# EAGLE design main (EAGLE 5.11)

## Sheet 1 of 7
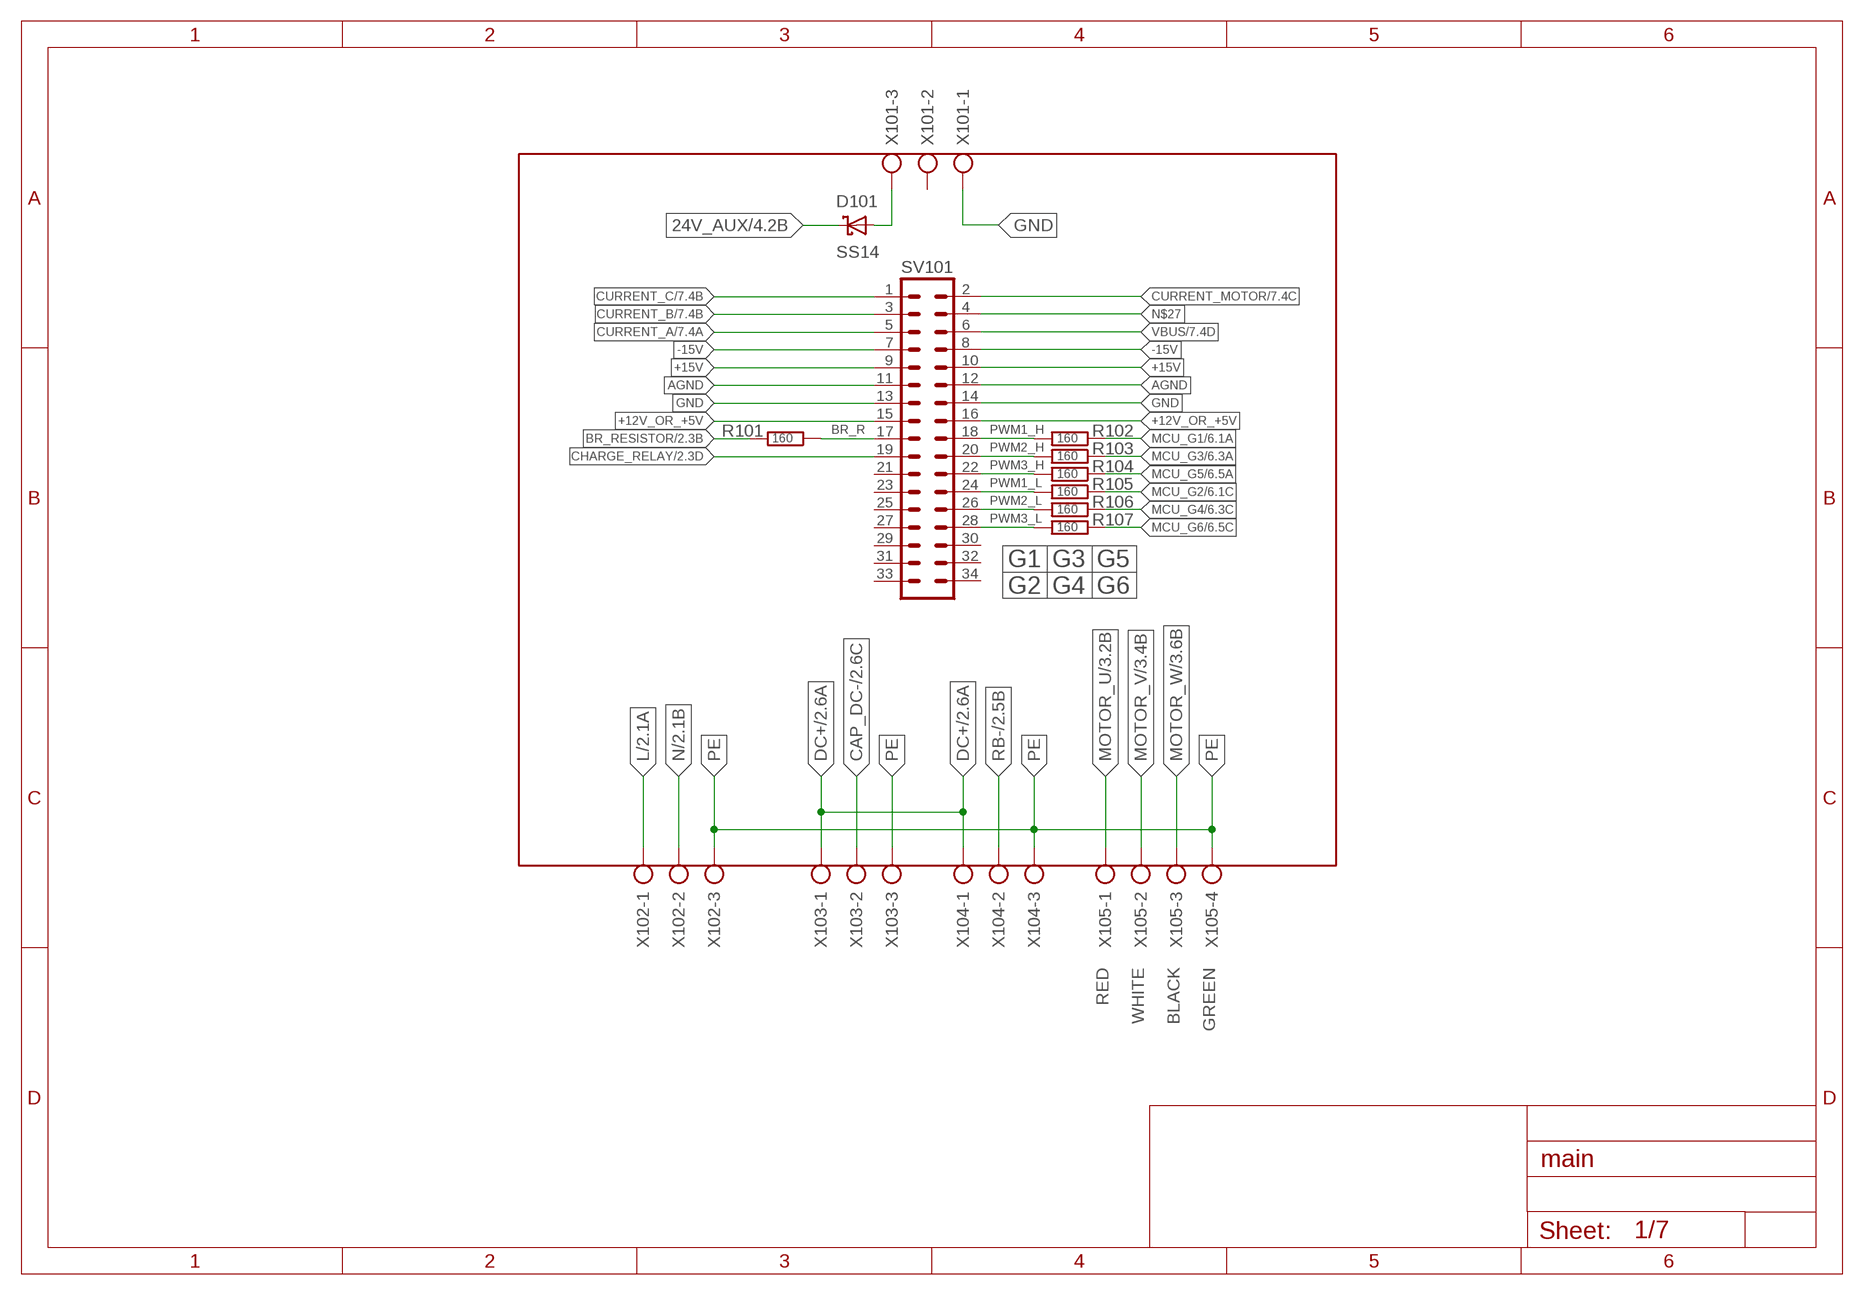
[diagram p0: schematic, sheet 1]

### Parts
D101  SS14  1N581SMD  [DO214AC]
R101  160  R-EU_R1206  [R1206]
R102  160  R-EU_R1206  [R1206]
R103  160  R-EU_R1206  [R1206]
R104  160  R-EU_R1206  [R1206]
R105  160  R-EU_R1206  [R1206]
R106  160  R-EU_R1206  [R1206]
R107  160  R-EU_R1206  [R1206]
SV101  ML34  [ML34]
X101  AK500/3-H  [AK500/3-H]
X102  AK500/3-H  [AK500/3-H]
X103  AK500/3-H  [AK500/3-H]
X104  AK500/3-H  [AK500/3-H]
X105  AK500/4-H  [AK500/4-H]

### Nets
24V_AUX: D101.C ; also sheet 4
+12V_OR_+5V: SV101.15 SV101.16 ; also sheet 2,4,5
+15V: SV101.9 SV101.10 ; also sheet 4,7
-15V: SV101.7 SV101.8 ; also sheet 4,7
AGND: SV101.11 SV101.12 ; also sheet 4,7
BR_R: R101.1 SV101.17
BR_RESISTOR: R101.2 ; also sheet 2
CAP_DC-: X103.2 ; also sheet 2,7
CHARGE_RELAY: SV101.19 ; also sheet 2
CURRENT_A: SV101.5 ; also sheet 7
CURRENT_B: SV101.3 ; also sheet 7
CURRENT_C: SV101.1 ; also sheet 7
CURRENT_MOTOR: SV101.2 ; also sheet 7
DC+: X103.1 X104.1 ; also sheet 2,3
GND: SV101.13 SV101.14 X101.1 ; also sheet 2,4,5,6
L: X102.1 ; also sheet 2
MCU_G1: R102.1 ; also sheet 6
MCU_G2: R105.1 ; also sheet 6
MCU_G3: R103.1 ; also sheet 6
MCU_G4: R106.1 ; also sheet 6
MCU_G5: R104.1 ; also sheet 6
MCU_G6: R107.1 ; also sheet 6
MOTOR_U: X105.1 ; also sheet 3,7
MOTOR_V: X105.2 ; also sheet 3,7
MOTOR_W: X105.3 ; also sheet 3,7
N: X102.2 ; also sheet 2
N$27: SV101.4
N$42: D101.A X101.3
PE: X102.3 X103.3 X104.3 X105.4
PWM1_H: R102.2 SV101.18
PWM1_L: R105.2 SV101.24
PWM2_H: R103.2 SV101.20
PWM2_L: R106.2 SV101.26
PWM3_H: R104.2 SV101.22
PWM3_L: R107.2 SV101.28
RB-: X104.2 ; also sheet 2
VBUS: SV101.6 ; also sheet 7
Unconnected: SV101.21 SV101.23 SV101.25 SV101.27 SV101.29 SV101.30 SV101.31 SV101.32 SV101.33 SV101.34 X101.2

### Notes on the sheet
- G1 | G3 | G5
- G2 | G4 | G6
- RED | WHITE | BLACK | GREEN

## Sheet 2 of 7
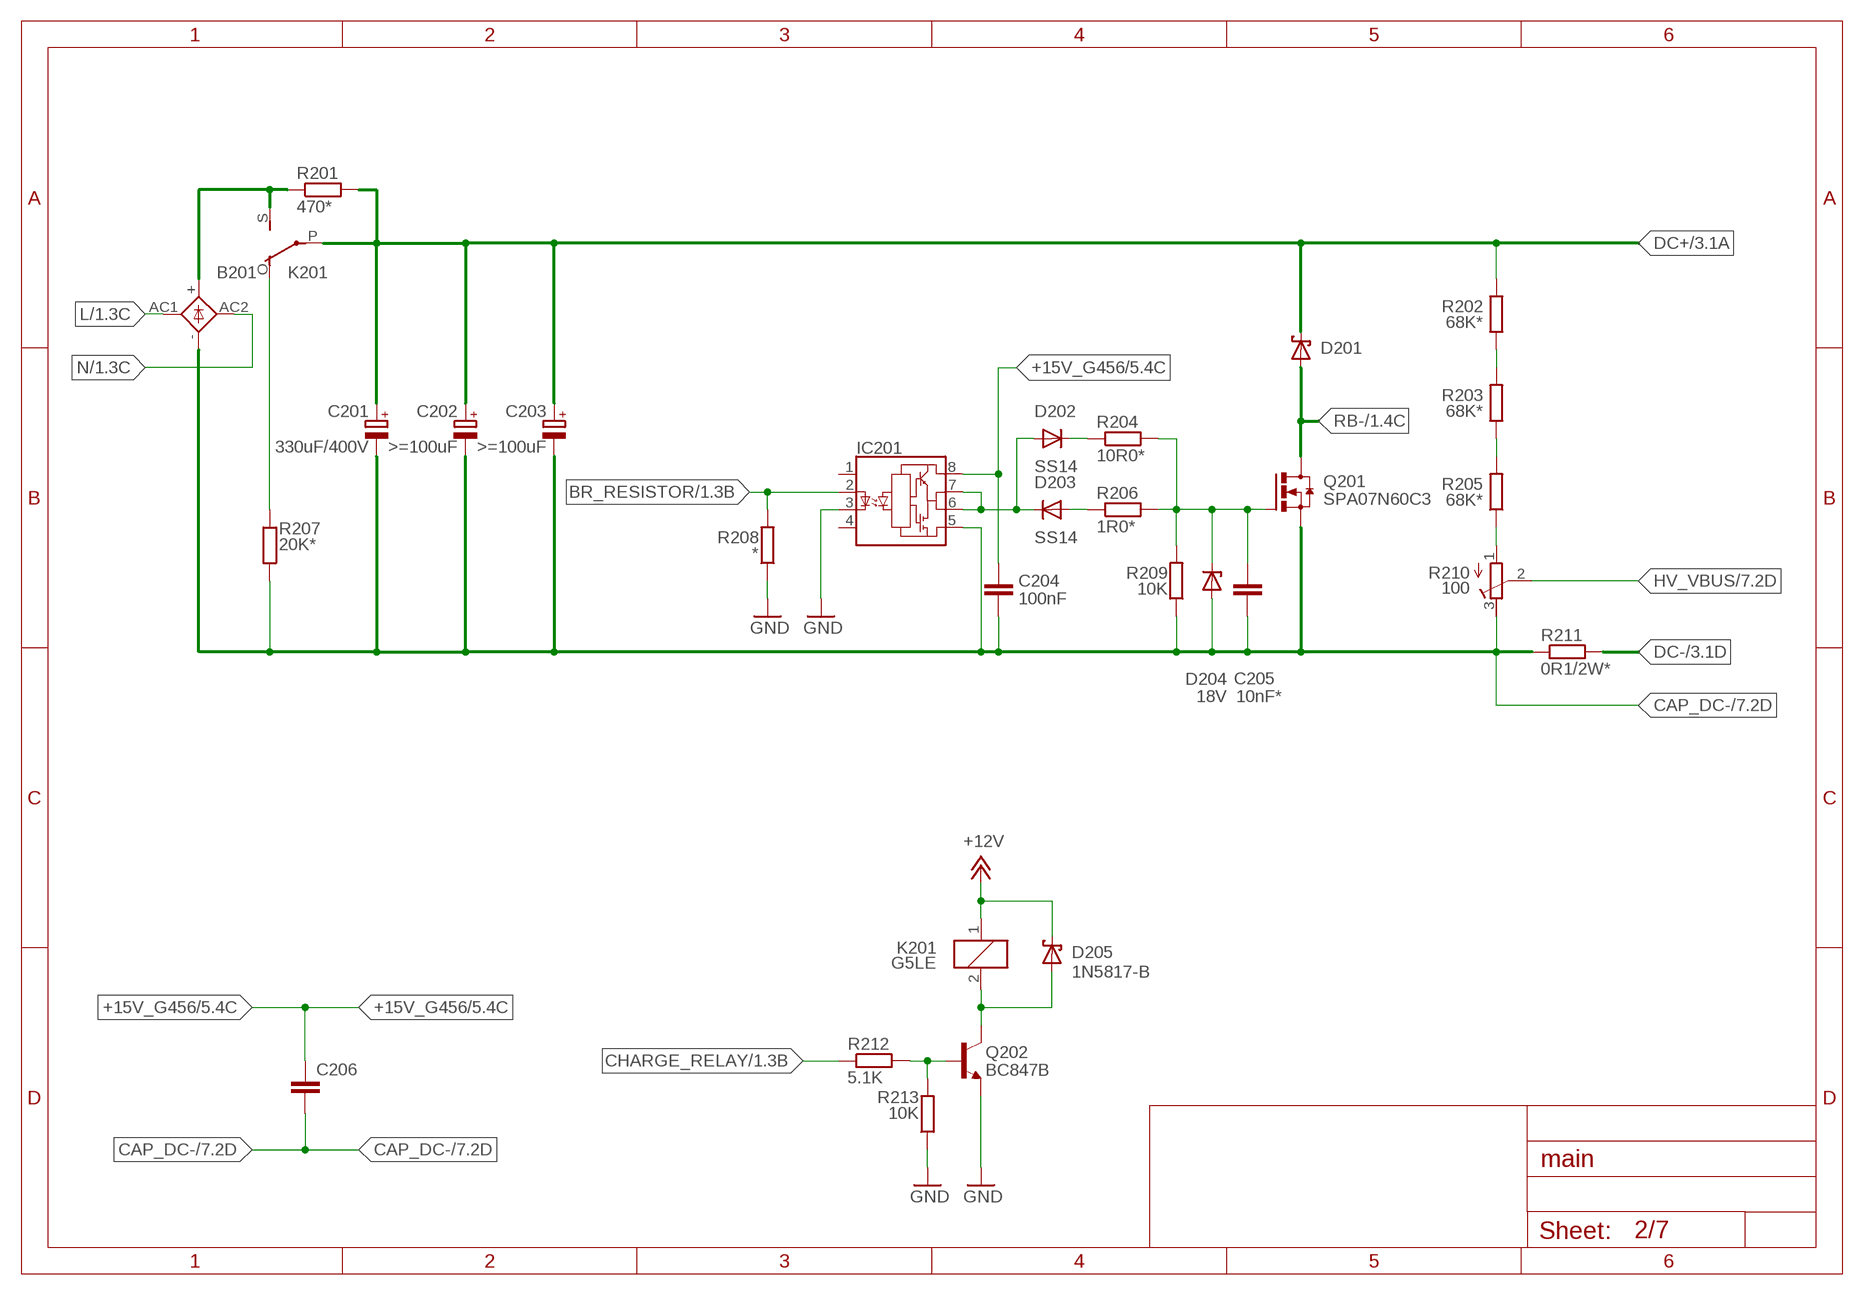
[diagram p1: schematic, sheet 2]

### Parts
B201  KBU  [KBU]
C201  330uF/400V  CPOL-EUE10-22.5  [EB22,5D]
C202  >=100uF  CPOL-EUE10-22.5  [EB22,5D]
C203  >=100uF  CPOL-EUE10-22.5  [EB22,5D]
C204  100nF  C-EUC0603  [C0603]
C205  10nF*  C-EUC0805  [C0805]
C206  C-EUC1206  [C1206]
D201  1N581SMD  [DO214AC]
D202  SS14  DIODE-DO214AA  [DO214AA]
D203  SS14  DIODE-DO214AA  [DO214AA]
D204  18V  ZENER-DIODESOD80C  [SOD80C]
D205  1N5817-B  1N581SMD  [DO214AC]
IC201  ELDI  [DIL8-SMD]
K201  G5LE  [G5LE]
Q201  SPA07N60C3  IRFZ48  [TO220BH-HV1]
Q202  BC847B  BC849SMD  [SOT23-BEC]
R201  470*  R-EU_VTA52  [VTA52]
R202  68K*  R-EU_0204/2V  [0204V]
R203  68K*  R-EU_0204/2V  [0204V]
R204  10R0*  R-EU_R0805  [R0805]
R205  68K*  R-EU_0204/2V  [0204V]
R206  1R0*  R-EU_R0805  [R0805]
R207  20K*  R-EU_RDH/15  [RDH/15]
R208  *  R-EU_R1206  [R1206]
R209  10K  R-EU_M0805  [M0805]
R210  100  R-TRIMM3296W  [RTRIM3296W]
R211  0R1/2W*  R-EU_R2512  [R2512]
R212  5.1K  R-EU_R0805  [R0805]
R213  10K  R-EU_R0805  [R0805]

### Nets
+12V_OR_+5V: D205.C K201.1 ; supply symbol labelled +12V ; also sheet 1,4,5
+15V_G456: C204.1 C206.1 IC201.8 ; also sheet 5,6,7
BR_RESISTOR: IC201.2 R208.2 ; also sheet 1
CAP_DC-: B201.- C201.- C202.- C203.- C204.2 C205.2 C206.2 D204.A IC201.5 Q201.S R207.1 R209.1 R210.3(A) R211.1 ; also sheet 1,7
CHARGE_RELAY: R212.1 ; also sheet 1
DC+: C201.+ C202.+ C203.+ D201.C K201.P(2:P) R201.2 R202.2 ; also sheet 1,3
DC-: R211.2 ; also sheet 3,5,6,7
GND: IC201.3 Q202.E R208.1 R213.1 ; also sheet 1,4,5,6
HV_VBUS: R210.2(S) ; also sheet 7
L: B201.AC1 ; also sheet 1
N: B201.AC2 ; also sheet 1
N$5: D202.A D203.C IC201.6 IC201.7
N$9: K201.O(2:O) R207.2
N$10: R203.1 R205.2
N$11: D202.C R204.1
N$12: D203.A R206.1
N$13: C205.1 D204.C Q201.G R204.2 R206.2 R209.2
N$14: B201.+ K201.S(2:S) R201.1
N$16: R202.1 R203.2
N$24: R205.1 R210.1(E)
N$31: D205.A K201.2 Q202.C
N$32: Q202.B R212.2 R213.2
RB-: D201.A Q201.D ; also sheet 1
Unconnected: IC201.1 IC201.4

## Sheet 3 of 7
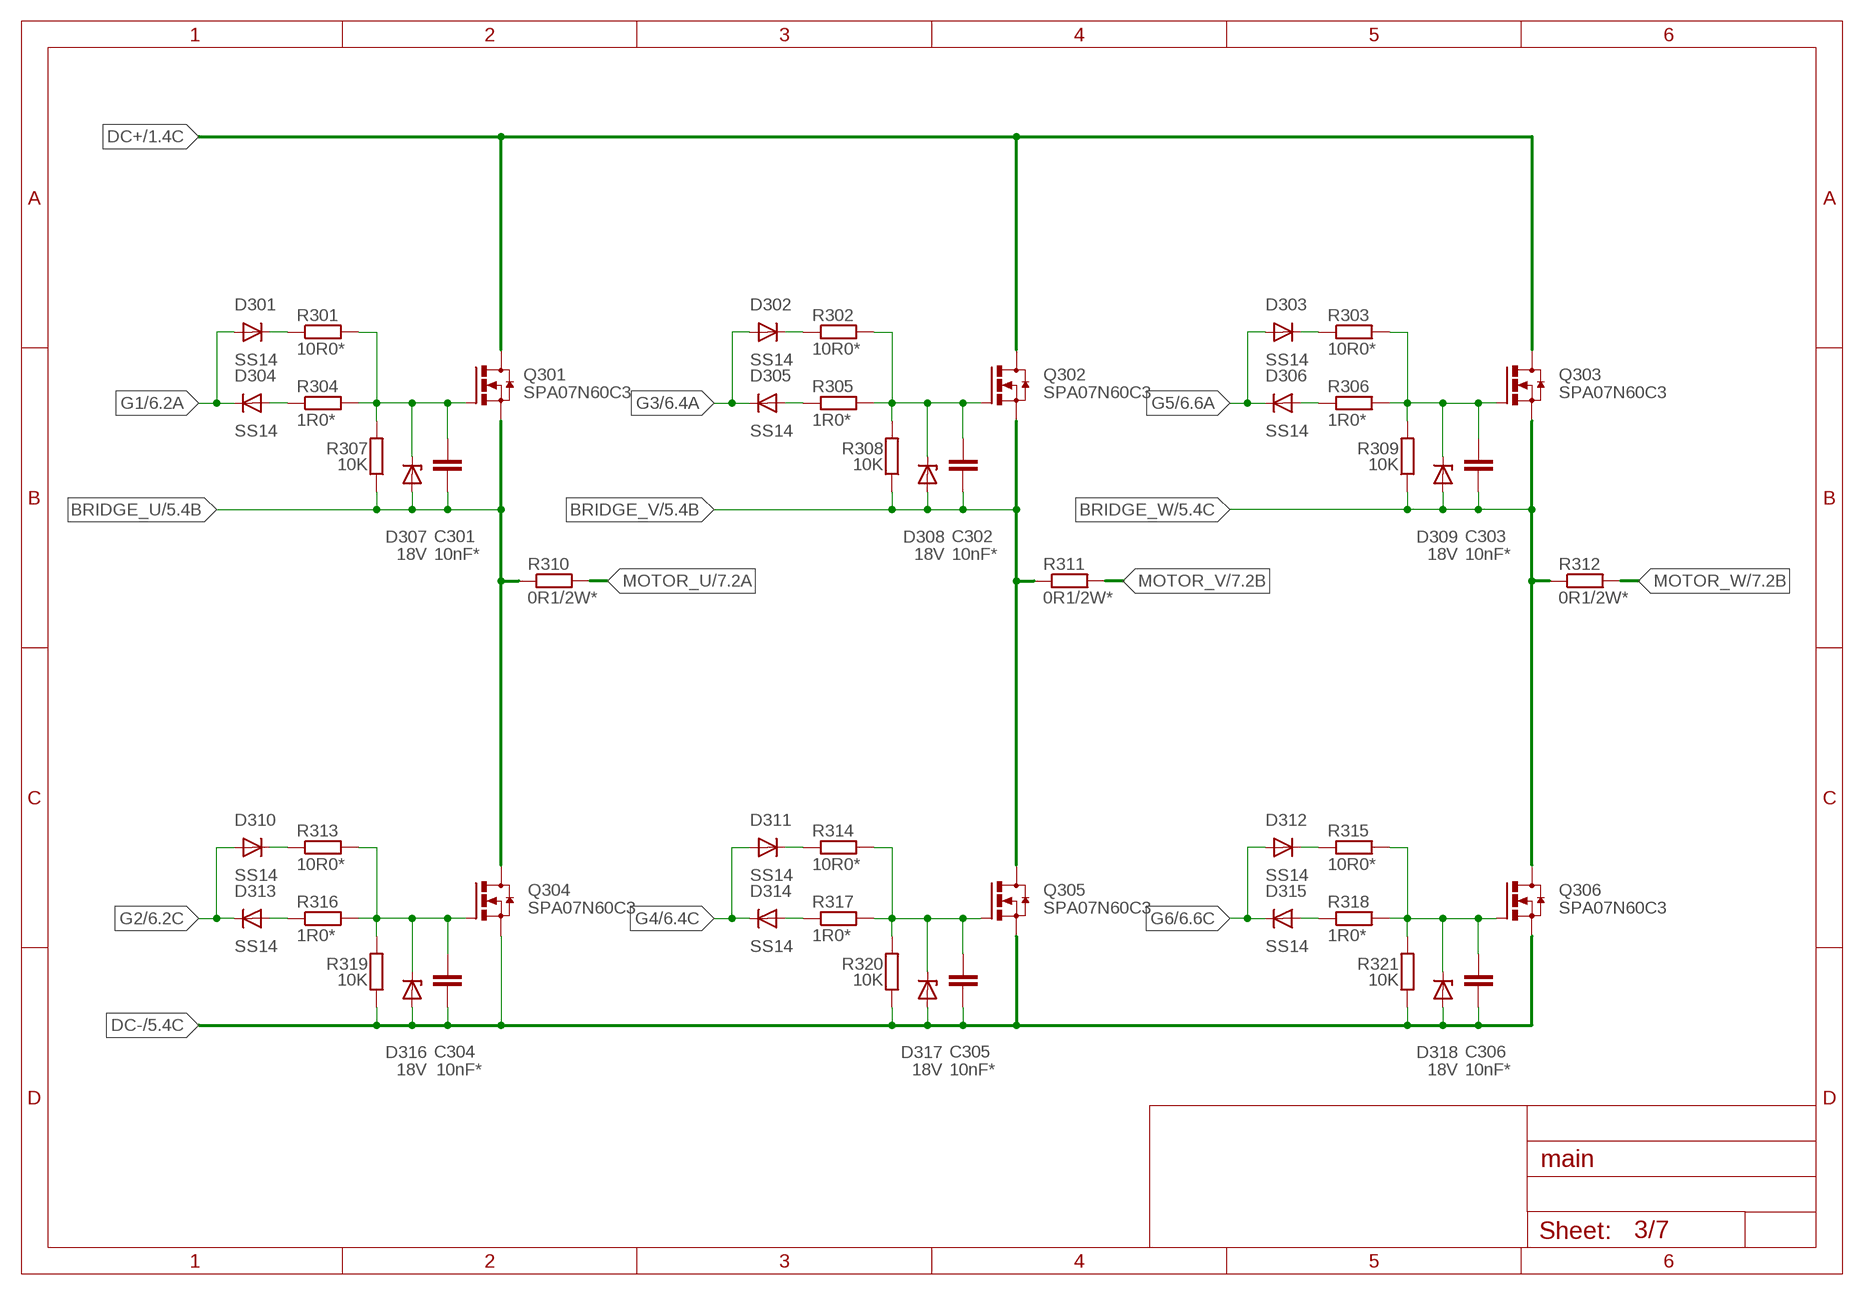
[diagram p2: schematic, sheet 3]

### Parts
C301  10nF*  C-EUC0805  [C0805]
C302  10nF*  C-EUC0805  [C0805]
C303  10nF*  C-EUC0805  [C0805]
C304  10nF*  C-EUC0805  [C0805]
C305  10nF*  C-EUC0805  [C0805]
C306  10nF*  C-EUC0805  [C0805]
D301  SS14  DIODE-DO214AA  [DO214AA]
D302  SS14  DIODE-DO214AA  [DO214AA]
D303  SS14  DIODE-DO214AA  [DO214AA]
D304  SS14  DIODE-DO214AA  [DO214AA]
D305  SS14  DIODE-DO214AA  [DO214AA]
D306  SS14  DIODE-DO214AA  [DO214AA]
D307  18V  ZENER-DIODESOD80C  [SOD80C]
D308  18V  ZENER-DIODESOD80C  [SOD80C]
D309  18V  ZENER-DIODESOD80C  [SOD80C]
D310  SS14  DIODE-DO214AA  [DO214AA]
D311  SS14  DIODE-DO214AA  [DO214AA]
D312  SS14  DIODE-DO214AA  [DO214AA]
D313  SS14  DIODE-DO214AA  [DO214AA]
D314  SS14  DIODE-DO214AA  [DO214AA]
D315  SS14  DIODE-DO214AA  [DO214AA]
D316  18V  ZENER-DIODESOD80C  [SOD80C]
D317  18V  ZENER-DIODESOD80C  [SOD80C]
D318  18V  ZENER-DIODESOD80C  [SOD80C]
Q301  SPA07N60C3  IRFZ48  [TO220BH-HV1]
Q302  SPA07N60C3  IRFZ48  [TO220BH-HV1]
Q303  SPA07N60C3  IRFZ48  [TO220BH-HV1]
Q304  SPA07N60C3  IRFZ48  [TO220BH-HV1]
Q305  SPA07N60C3  IRFZ48  [TO220BH-HV1]
Q306  SPA07N60C3  IRFZ48  [TO220BH-HV1]
R301  10R0*  R-EU_R0805  [R0805]
R302  10R0*  R-EU_R0805  [R0805]
R303  10R0*  R-EU_R0805  [R0805]
R304  1R0*  R-EU_R0805  [R0805]
R305  1R0*  R-EU_R0805  [R0805]
R306  1R0*  R-EU_R0805  [R0805]
R307  10K  R-EU_M0805  [M0805]
R308  10K  R-EU_M0805  [M0805]
R309  10K  R-EU_M0805  [M0805]
R310  0R1/2W*  R-EU_R2512  [R2512]
R311  0R1/2W*  R-EU_R2512  [R2512]
R312  0R1/2W*  R-EU_R2512  [R2512]
R313  10R0*  R-EU_R0805  [R0805]
R314  10R0*  R-EU_R0805  [R0805]
R315  10R0*  R-EU_R0805  [R0805]
R316  1R0*  R-EU_R0805  [R0805]
R317  1R0*  R-EU_R0805  [R0805]
R318  1R0*  R-EU_R0805  [R0805]
R319  10K  R-EU_M0805  [M0805]
R320  10K  R-EU_M0805  [M0805]
R321  10K  R-EU_M0805  [M0805]

### Nets
BRIDGE_U: C301.2 D307.A Q301.S Q304.D R307.1 R310.1 ; also sheet 5,6,7
BRIDGE_V: C302.2 D308.A Q302.S Q305.D R308.1 R311.1 ; also sheet 5,6,7
BRIDGE_W: C303.2 D309.A Q303.S Q306.D R309.1 R312.1 ; also sheet 5,6,7
DC+: Q301.D Q302.D Q303.D ; also sheet 1,2
DC-: C304.2 C305.2 C306.2 D316.A D317.A D318.A Q304.S Q305.S Q306.S R319.1 R320.1 R321.1 ; also sheet 2,5,6,7
G1: D301.A D304.C ; also sheet 6
G2: D310.A D313.C ; also sheet 6
G3: D302.A D305.C ; also sheet 6
G4: D311.A D314.C ; also sheet 6
G5: D303.A D306.C ; also sheet 6
G6: D312.A D315.C ; also sheet 6
MOTOR_U: R310.2 ; also sheet 1,7
MOTOR_V: R311.2 ; also sheet 1,7
MOTOR_W: R312.2 ; also sheet 1,7
N$6: D311.C R314.1
N$7: C303.1 D309.C Q303.G R303.2 R306.2 R309.2
N$8: D310.C R313.1
N$26: D314.A R317.1
N$30: D313.A R316.1
N$35: C305.1 D317.C Q305.G R314.2 R317.2 R320.2
N$36: C304.1 D316.C Q304.G R313.2 R316.2 R319.2
N$37: D302.C R302.1
N$38: D305.A R305.1
N$39: D301.C R301.1
N$40: C302.1 D308.C Q302.G R302.2 R305.2 R308.2
N$41: D304.A R304.1
N$43: C301.1 D307.C Q301.G R301.2 R304.2 R307.2
N$44: D303.C R303.1
N$45: D306.A R306.1
N$47: D312.C R315.1
N$48: D315.A R318.1
N$49: C306.1 D318.C Q306.G R315.2 R318.2 R321.2

## Sheet 4 of 7
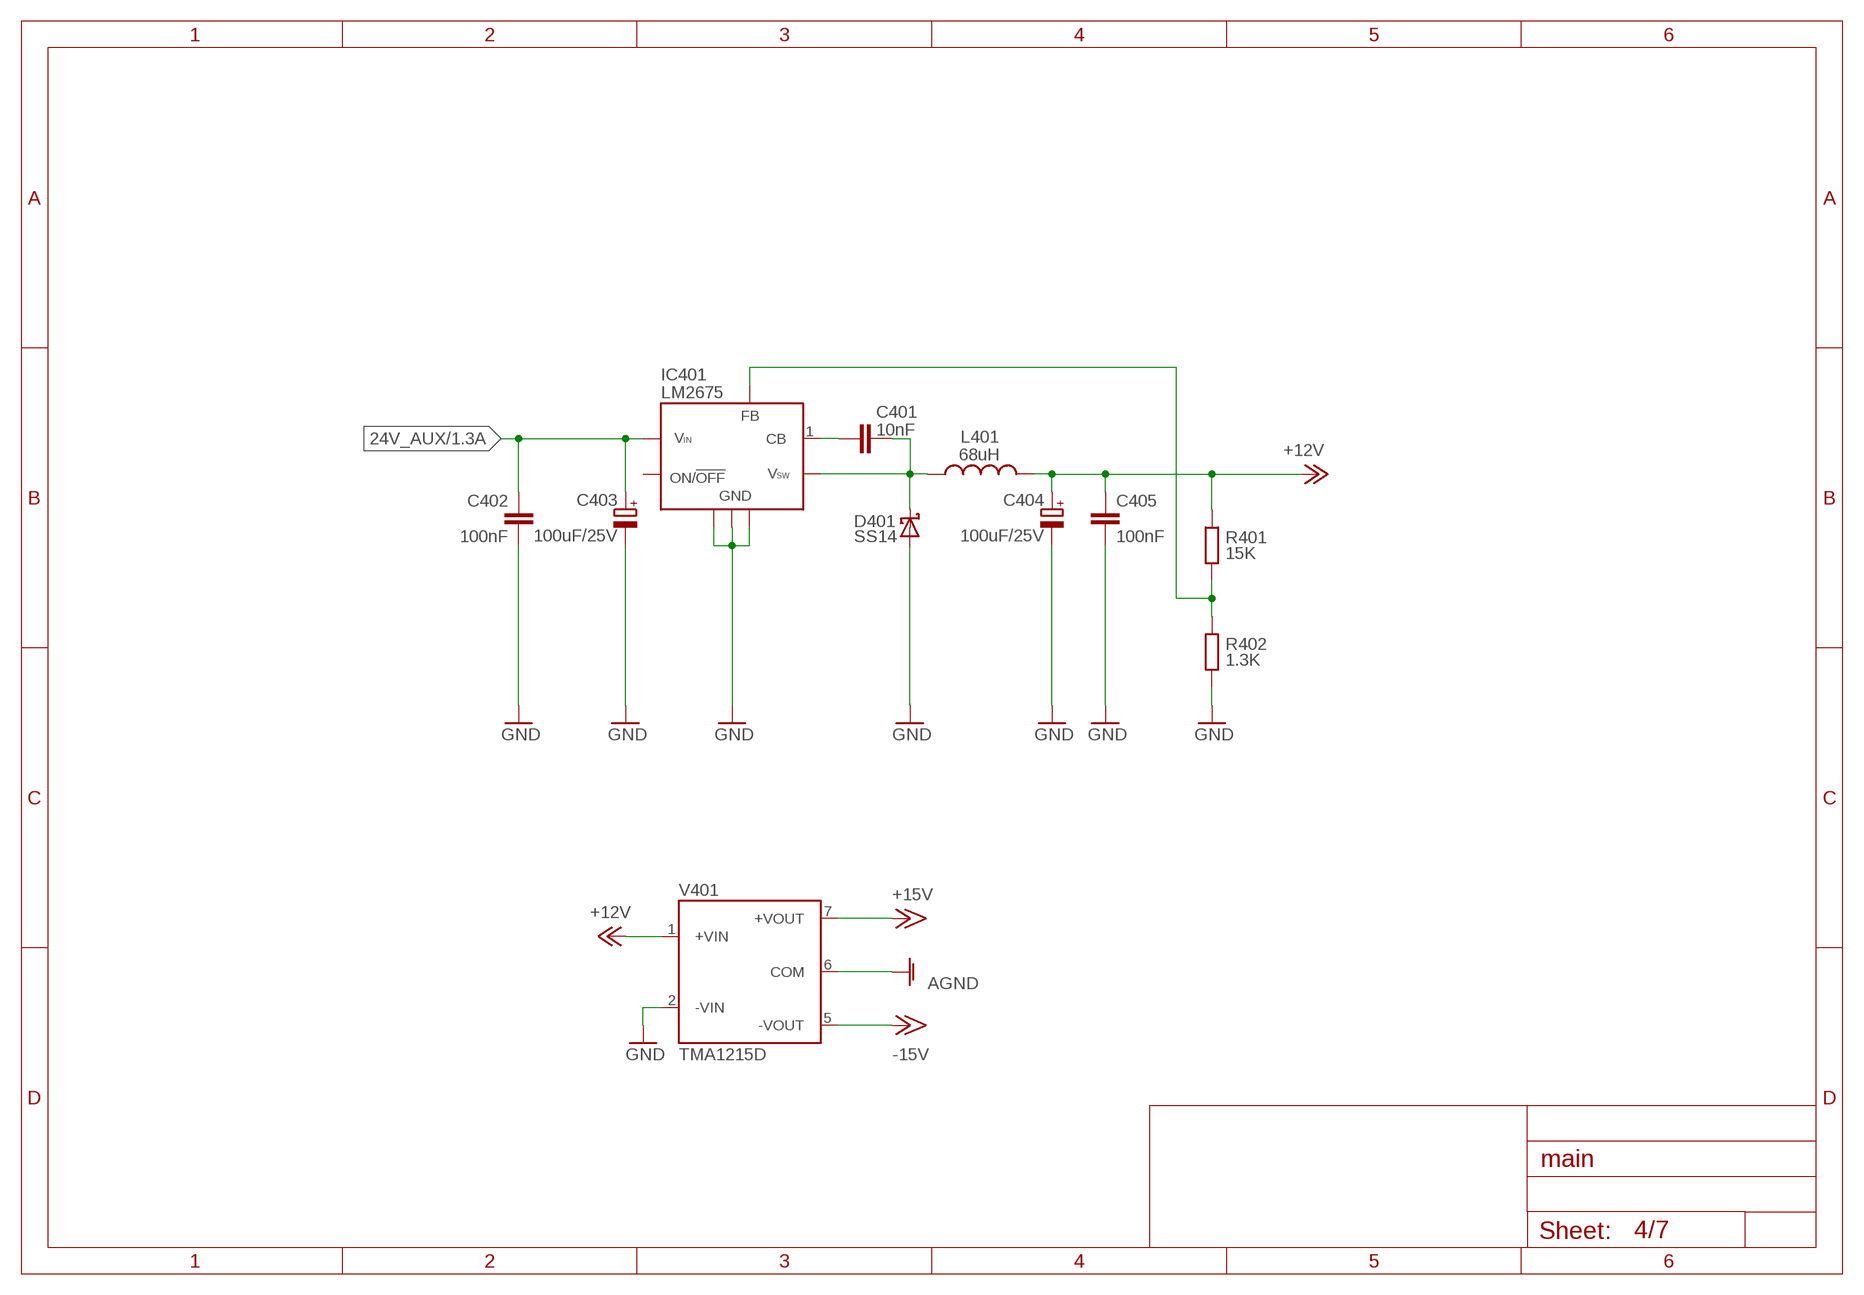
[diagram p3: schematic, sheet 4]

### Parts
C401  10nF  C-EUC0603  [C0603]
C402  100nF  C-EUC0603  [C0603]
C403  100uF/25V  CPOL-EUE2.5-5  [E2,5-5]
C404  100uF/25V  CPOL-EUE2,5-6E  [E2,5-6E]
C405  100nF  C-EUC0603  [C0603]
D401  SS14  1N581SMD  [DO214AC]
IC401  LM2675  [SO08]
L401  68uH  L-USSW45-V  [CW45-V]
R401  15K  R-EU_0204/2V  [0204V]
R402  1.3K  R-EU_R0603  [R0603]
V401  TMA1215D  TMA0515D  [TMA_DUAL]

### Nets
24V_AUX: C402.1 C403.+ IC401.7(VIN) ; also sheet 1
+12V_OR_+5V: C404.+ C405.1 L401.P$2 R401.2 V401.1(+VIN) ; supply symbol labelled +12V ; also sheet 1,2,5
+15V: V401.7(+VOUT) ; also sheet 1,7
-15V: V401.5(-VOUT) ; also sheet 1,7
AGND: V401.6(COM) ; also sheet 1,7
GND: C402.2 C403.- C404.- C405.2 D401.A IC401.2 IC401.3 IC401.6(GND) R402.1 V401.2(-VIN) ; also sheet 1,2,5,6
N$28: IC401.4(FB) R401.1 R402.2
N$72: C401.2 D401.C IC401.8(VSW) L401.P$1
N$80: C401.1 IC401.1(CB)
Unconnected: IC401.5(ON/!OFF)

## Sheet 5 of 7
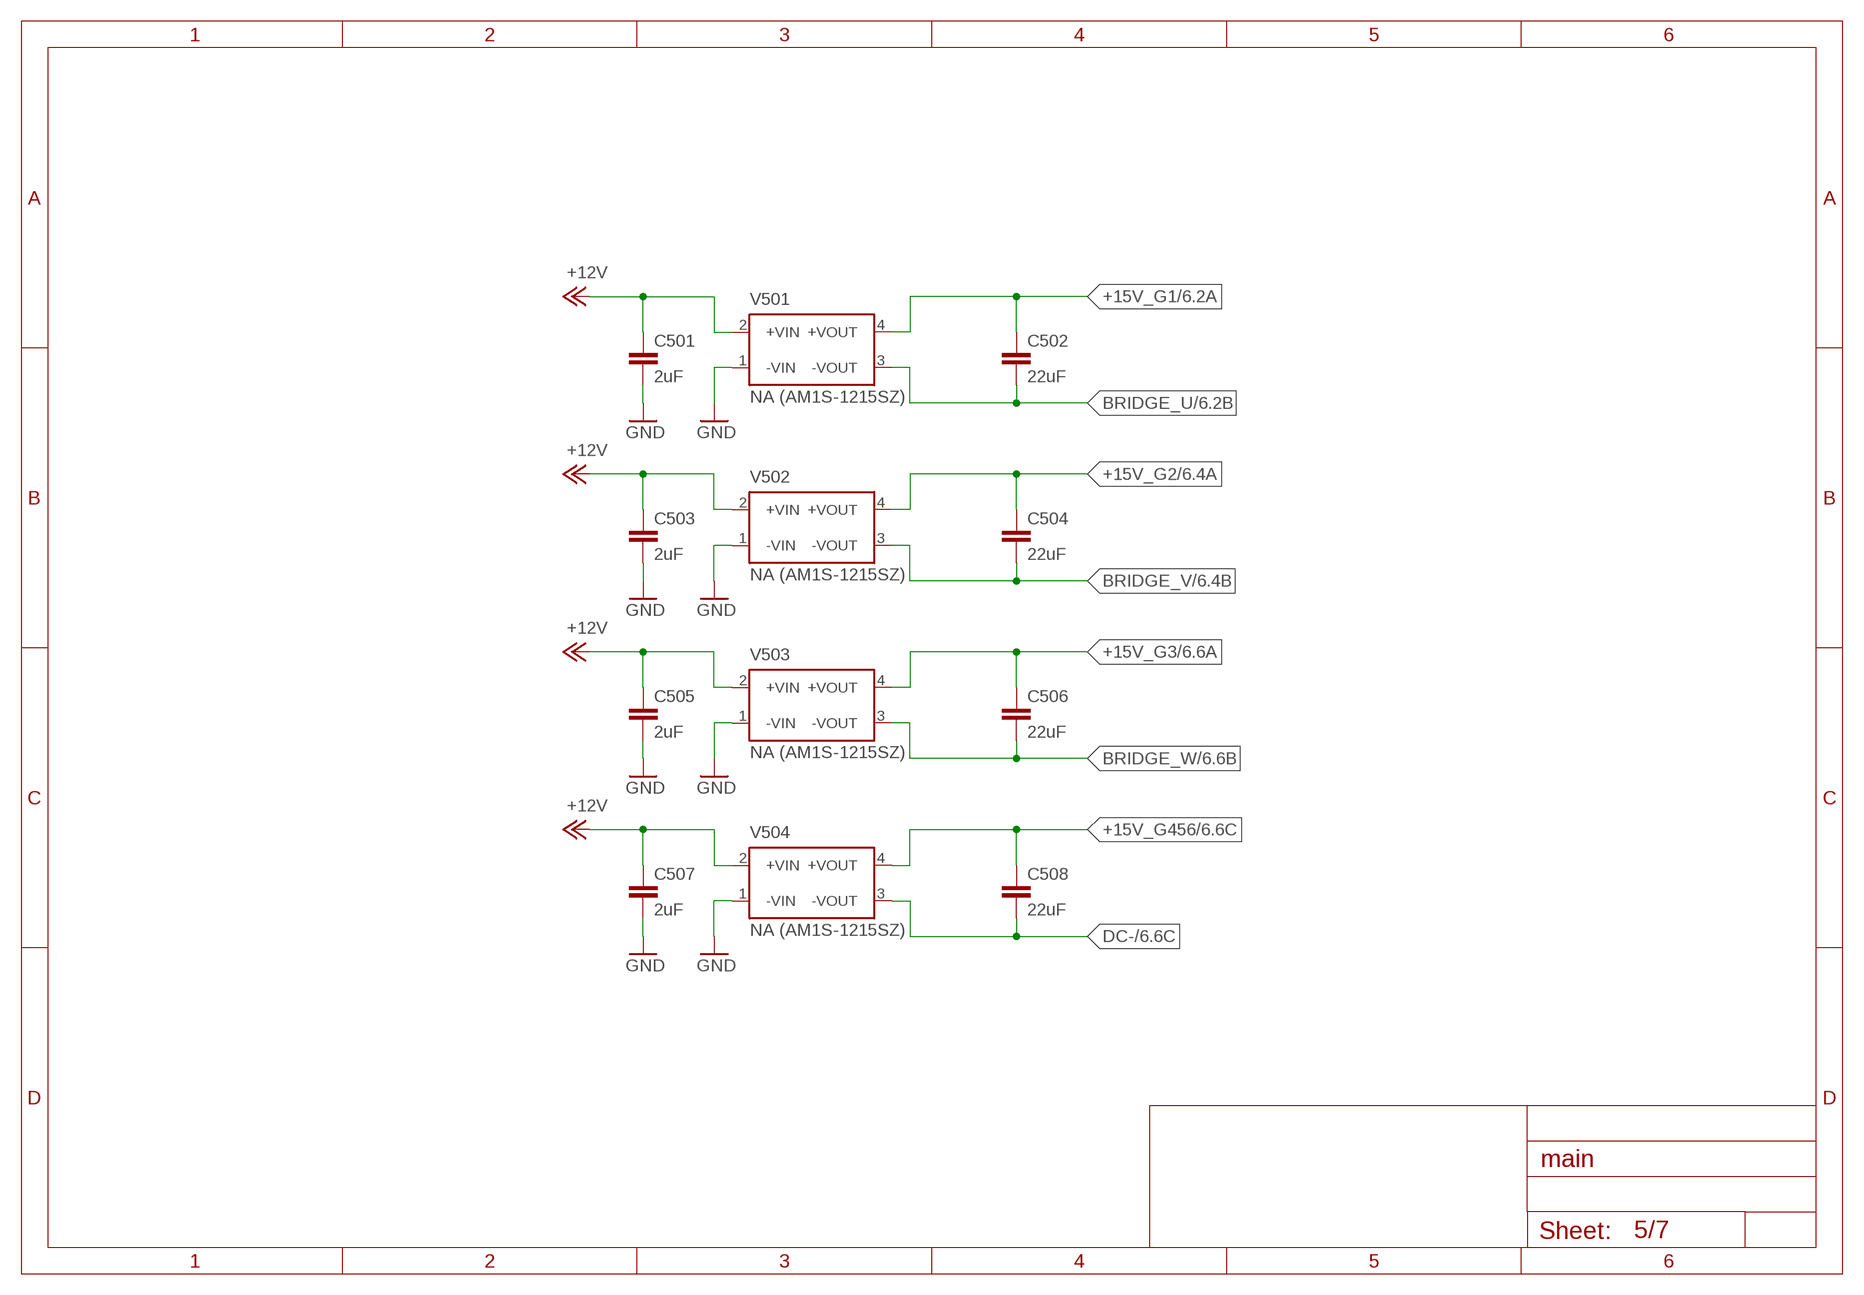
[diagram p4: schematic, sheet 5]

### Parts
C501  2uF  C-EUC1206  [C1206]
C502  22uF  C-EUC1206  [C1206]
C503  2uF  C-EUC1206  [C1206]
C504  22uF  C-EUC1206  [C1206]
C505  2uF  C-EUC1206  [C1206]
C506  22uF  C-EUC1206  [C1206]
C507  2uF  C-EUC1206  [C1206]
C508  22uF  C-EUC1206  [C1206]
V501  NA (AM1S-1215SZ)  TME0505S  [TME]
V502  NA (AM1S-1215SZ)  TME0505S  [TME]
V503  NA (AM1S-1215SZ)  TME0505S  [TME]
V504  NA (AM1S-1215SZ)  TME0505S  [TME]

### Nets
+12V_OR_+5V: C501.1 C503.1 C505.1 C507.1 V501.2(+VIN) V502.2(+VIN) V503.2(+VIN) V504.2(+VIN) ; supply symbol labelled +12V ; also sheet 1,2,4
+15V_G1: C502.1 V501.4(+VOUT) ; also sheet 6,7
+15V_G2: C504.1 V502.4(+VOUT) ; also sheet 6,7
+15V_G3: C506.1 V503.4(+VOUT) ; also sheet 6,7
+15V_G456: C508.1 V504.4(+VOUT) ; also sheet 2,6,7
BRIDGE_U: C502.2 V501.3(-VOUT) ; also sheet 3,6,7
BRIDGE_V: C504.2 V502.3(-VOUT) ; also sheet 3,6,7
BRIDGE_W: C506.2 V503.3(-VOUT) ; also sheet 3,6,7
DC-: C508.2 V504.3(-VOUT) ; also sheet 2,3,6,7
GND: C501.2 C503.2 C505.2 C507.2 V501.1(-VIN) V502.1(-VIN) V503.1(-VIN) V504.1(-VIN) ; also sheet 1,2,4,6

## Sheet 6 of 7
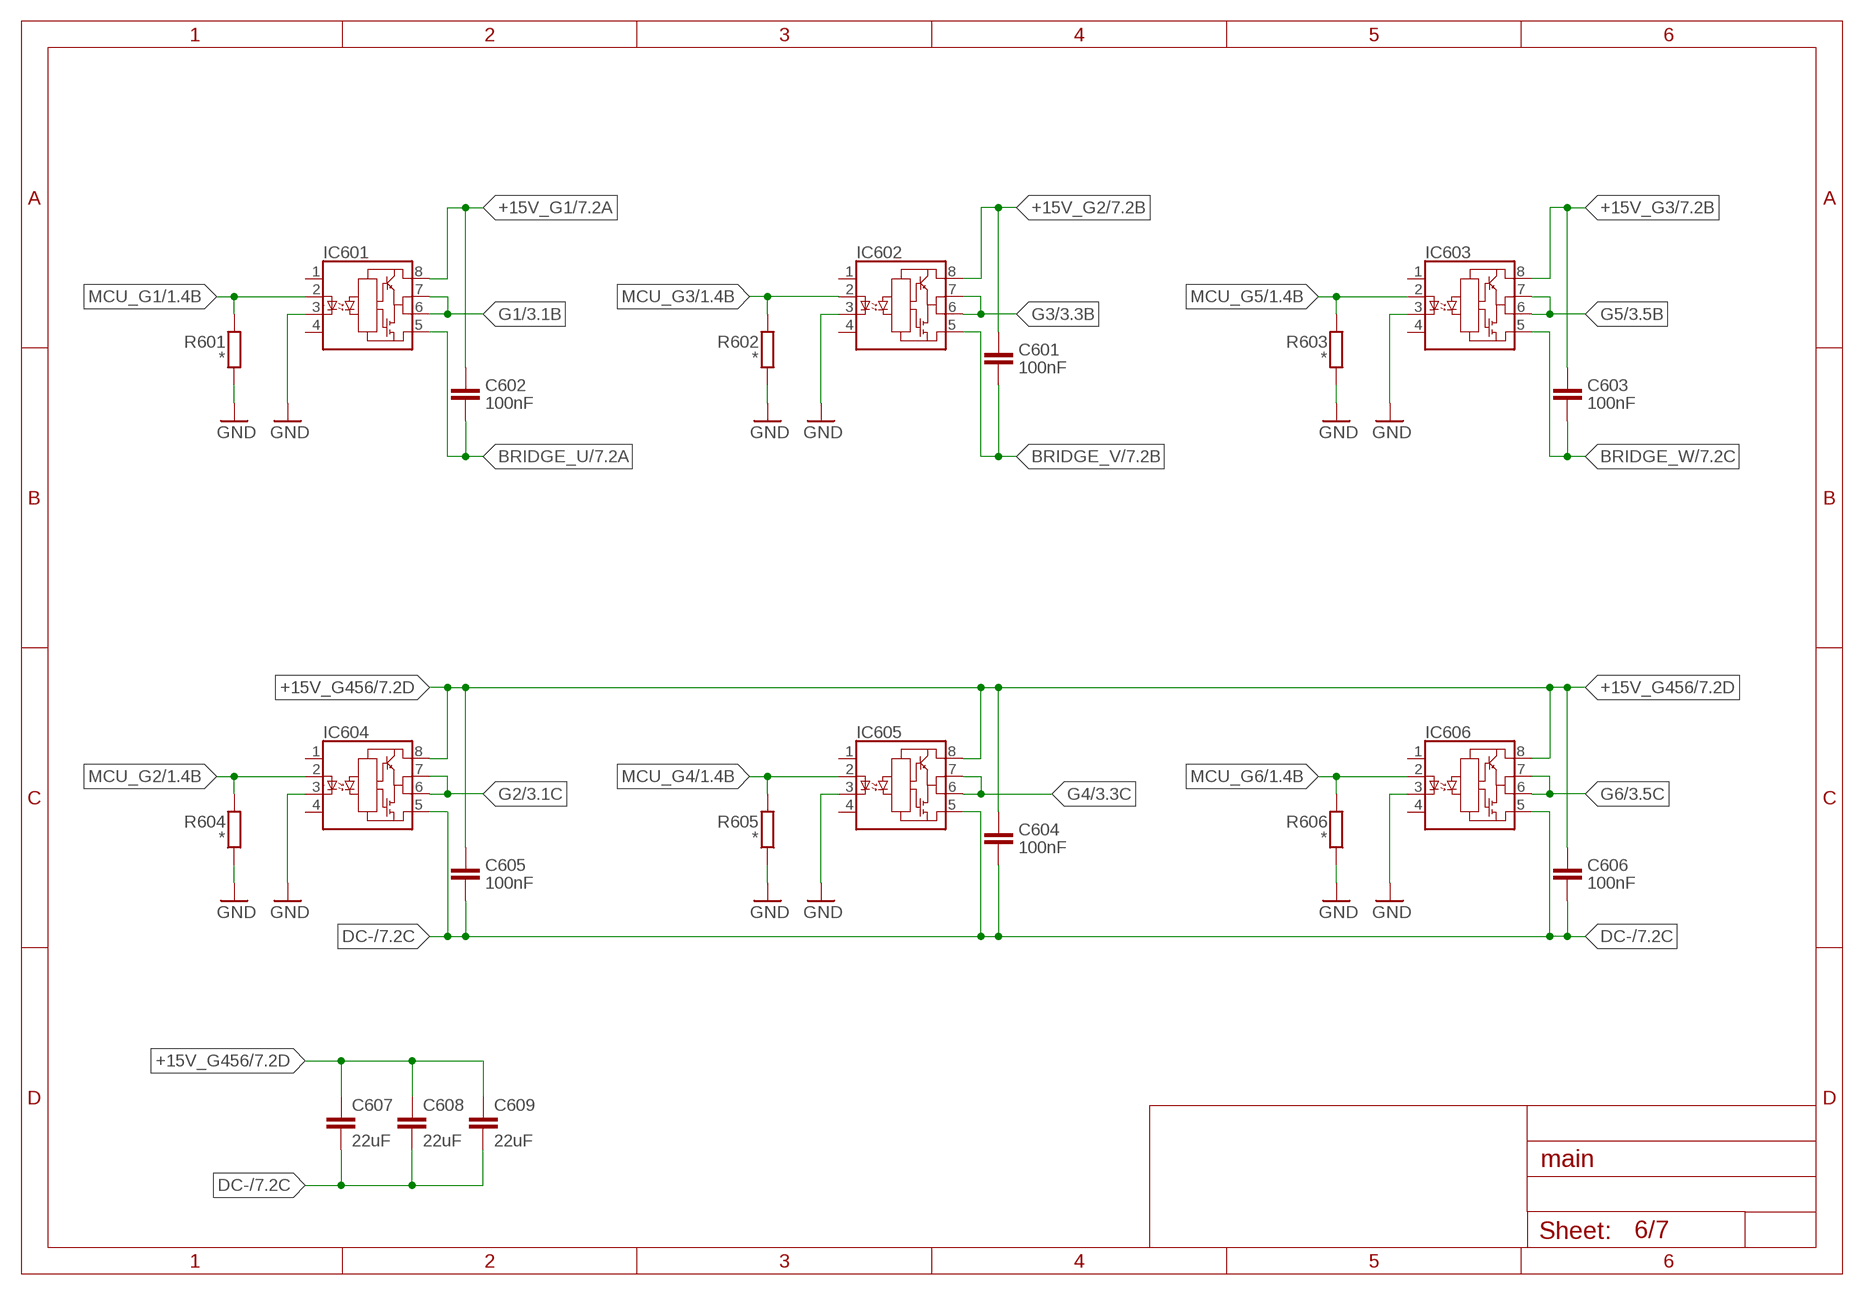
[diagram p5: schematic, sheet 6]

### Parts
C601  100nF  C-EUC0603  [C0603]
C602  100nF  C-EUC0603  [C0603]
C603  100nF  C-EUC0603  [C0603]
C604  100nF  C-EUC0603  [C0603]
C605  100nF  C-EUC0603  [C0603]
C606  100nF  C-EUC0603  [C0603]
C607  22uF  C-EUC1206  [C1206]
C608  22uF  C-EUC1206  [C1206]
C609  22uF  C-EUC1206  [C1206]
IC601  ELDI  [DIL8-SMD]
IC602  ELDI  [DIL8-SMD]
IC603  ELDI  [DIL8-SMD]
IC604  ELDI  [DIL8-SMD]
IC605  ELDI  [DIL8-SMD]
IC606  ELDI  [DIL8-SMD]
R601  *  R-EU_R1206  [R1206]
R602  *  R-EU_R1206  [R1206]
R603  *  R-EU_R1206  [R1206]
R604  *  R-EU_R1206  [R1206]
R605  *  R-EU_R1206  [R1206]
R606  *  R-EU_R1206  [R1206]

### Nets
+15V_G1: C602.1 IC601.8 ; also sheet 5,7
+15V_G2: C601.1 IC602.8 ; also sheet 5,7
+15V_G3: C603.1 IC603.8 ; also sheet 5,7
+15V_G456: C604.1 C605.1 C606.1 C607.1 C608.1 C609.1 IC604.8 IC605.8 IC606.8 ; also sheet 2,5,7
BRIDGE_U: C602.2 IC601.5 ; also sheet 3,5,7
BRIDGE_V: C601.2 IC602.5 ; also sheet 3,5,7
BRIDGE_W: C603.2 IC603.5 ; also sheet 3,5,7
DC-: C604.2 C605.2 C606.2 C607.2 C608.2 C609.2 IC604.5 IC605.5 IC606.5 ; also sheet 2,3,5,7
G1: IC601.6 IC601.7 ; also sheet 3
G2: IC604.6 IC604.7 ; also sheet 3
G3: IC602.6 IC602.7 ; also sheet 3
G4: IC605.6 IC605.7 ; also sheet 3
G5: IC603.6 IC603.7 ; also sheet 3
G6: IC606.6 IC606.7 ; also sheet 3
GND: IC601.3 IC602.3 IC603.3 IC604.3 IC605.3 IC606.3 R601.1 R602.1 R603.1 R604.1 R605.1 R606.1 ; also sheet 1,2,4,5
MCU_G1: IC601.2 R601.2 ; also sheet 1
MCU_G2: IC604.2 R604.2 ; also sheet 1
MCU_G3: IC602.2 R602.2 ; also sheet 1
MCU_G4: IC605.2 R605.2 ; also sheet 1
MCU_G5: IC603.2 R603.2 ; also sheet 1
MCU_G6: IC606.2 R606.2 ; also sheet 1
Unconnected: IC601.1 IC601.4 IC602.1 IC602.4 IC603.1 IC603.4 IC604.1 IC604.4 IC605.1 IC605.4 IC606.1 IC606.4

## Sheet 7 of 7
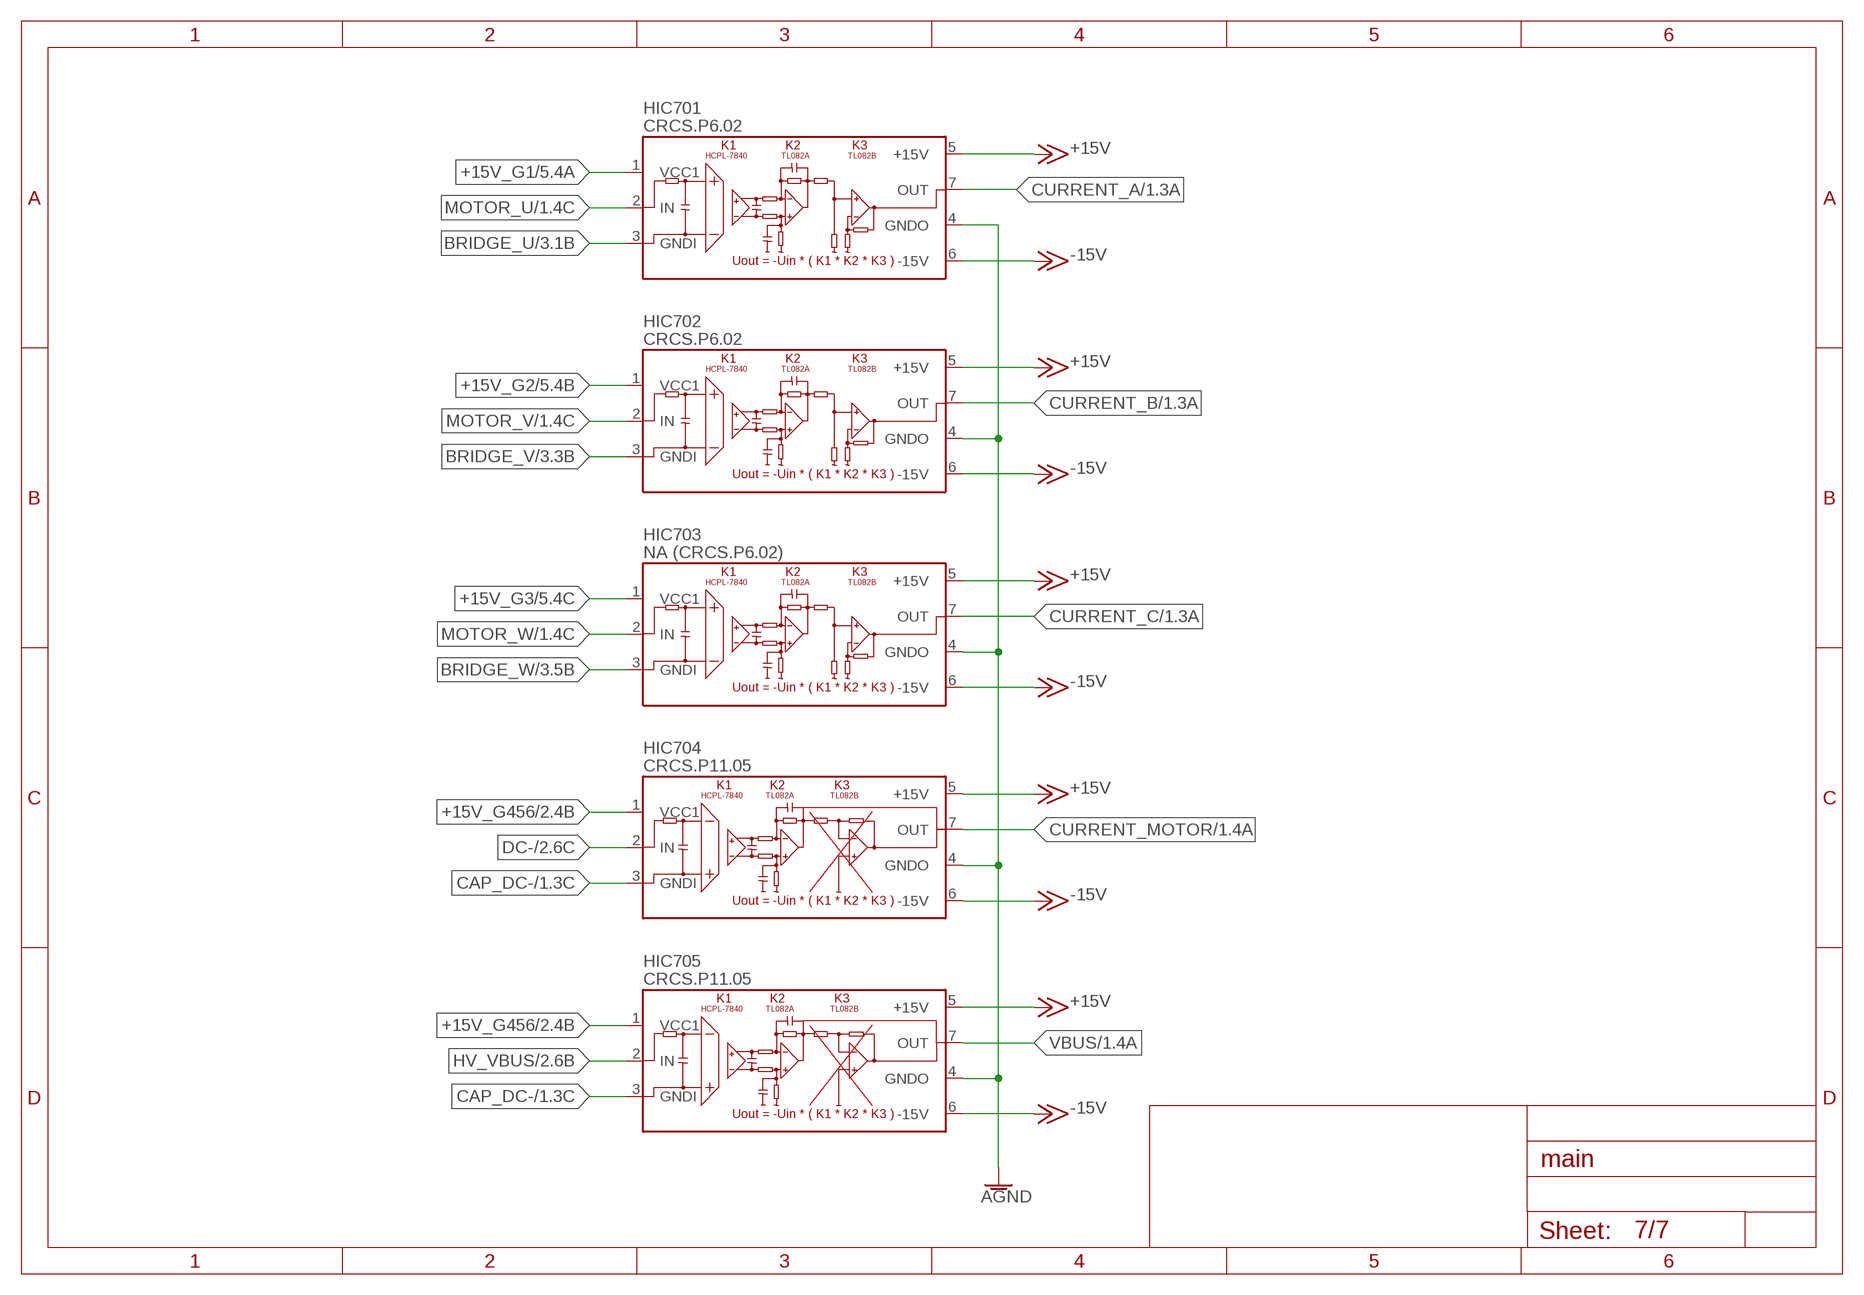
[diagram p6: schematic, sheet 7]

### Parts
HIC701  CRCS.P6.02  [CRCS.P6.02]
HIC702  CRCS.P6.02  [CRCS.P6.02]
HIC703  NA (CRCS.P6.02)  CRCS.P6.02  [CRCS.P6.02]
HIC704  CRCS.P11.05  [CRCS.P11.05]
HIC705  CRCS.P11.05  [CRCS.P11.05]

### Nets
+15V: HIC701.5(+15V) HIC702.5(+15V) HIC703.5(+15V) HIC704.5(+15V) HIC705.5(+15V) ; also sheet 1,4
+15V_G1: HIC701.1(VCC1) ; also sheet 5,6
+15V_G2: HIC702.1(VCC1) ; also sheet 5,6
+15V_G3: HIC703.1(VCC1) ; also sheet 5,6
+15V_G456: HIC704.1(VCC1) HIC705.1(VCC1) ; also sheet 2,5,6
-15V: HIC701.6(-15V) HIC702.6(-15V) HIC703.6(-15V) HIC704.6(-15V) HIC705.6(-15V) ; also sheet 1,4
AGND: HIC701.4(GNDO) HIC702.4(GNDO) HIC703.4(GNDO) HIC704.4(GNDO) HIC705.4(GNDO) ; also sheet 1,4
BRIDGE_U: HIC701.3(GNDI) ; also sheet 3,5,6
BRIDGE_V: HIC702.3(GNDI) ; also sheet 3,5,6
BRIDGE_W: HIC703.3(GNDI) ; also sheet 3,5,6
CAP_DC-: HIC704.3(GNDI) HIC705.3(GNDI) ; also sheet 1,2
CURRENT_A: HIC701.7(OUT) ; also sheet 1
CURRENT_B: HIC702.7(OUT) ; also sheet 1
CURRENT_C: HIC703.7(OUT) ; also sheet 1
CURRENT_MOTOR: HIC704.7(OUT) ; also sheet 1
DC-: HIC704.2(IN) ; also sheet 2,3,5,6
HV_VBUS: HIC705.2(IN) ; also sheet 2
MOTOR_U: HIC701.2(IN) ; also sheet 1,3
MOTOR_V: HIC702.2(IN) ; also sheet 1,3
MOTOR_W: HIC703.2(IN) ; also sheet 1,3
VBUS: HIC705.7(OUT) ; also sheet 1

## Library data of the parts
B201 = rectifier:KBU: DIOTEC RECTIFIER
C201-C203 C403 C404 = rcl:CPOL-EU: POLARIZED CAPACITOR, European symbol
C204-C206 C301-C306 C401 C402 C405 C501-C508 C601-C609 = rcl:C-EU: CAPACITOR, European symbol
D101 D201 D205 D401 = diode:1N581*: 1.0A SCHOTTKY BARRIER RECTIFIER Source: http://www.diodes.com/datasheets/ds23001.pdf
D202 D203 D301-D306 D310-D315 = diode:DIODE-: DIODE
D204 D307-D309 D316-D318 = diode:ZENER-DIODE: Z-Diode
HIC701-HIC703 = electroinvent:CRCS.P6.02
HIC704 HIC705 = electroinvent:CRCS.P11.05
IC201 IC601-IC606 = myOptocoupler:ELDI
IC401 = linear:LM2675
K201 = relay:G5LE: RELAY 1 x switch, 10 A/120 V AC, 8 A/30 V DC, Omron; OC_FARNELL: unknown; OC_NEWARK: unknown
L401 = rcl:L-US: INDUCTOR, American symbol
Q201 Q301-Q306 = myTransistor-Power:IRFZ48
Q202 = transistor-npn:BC849*: NPN Transistor
R101-R107 R201-R209 R211-R213 R301-R321 R401 R402 R601-R606 = rcl:R-EU_: RESISTOR, European symbol
R210 = rcl:R-TRIMM: Trimm resistor
SV101 = con-harting-ml:ML34: HARTING; OC_FARNELL: unknown; OC_NEWARK: unknown
V401 = myTraco-electronic:TMA*?
V501-V504 = traco-electronic:TME?*: DC/DC Converter TME Series 1 Watt Source: www.tracopower.com .. tme.pdf; MPN: TME 0505S; OC_FARNELL: 1007538; OC_NEWARK: 51R5321
X101-X104 = con-ptr500:AK500/3-H: CONNECTOR Aug. 2004 / PTR Meßtechnik: Die Bezeichnung der Serie AK505 wurde geändert. Es handelt sich hierbei um AK500 in horizontaler Ausführung.; OC_FARNELL: unknown; OC_NEWARK: unknown
X105 = con-ptr500:AK500/4-H: CONNECTOR Aug. 2004 / PTR Meßtechnik: Die Bezeichnung der Serie AK505 wurde geändert. Es handelt sich hierbei um AK500 in horizontaler Ausführung.; OC_FARNELL: unknown; OC_NEWARK: unknown

## Board
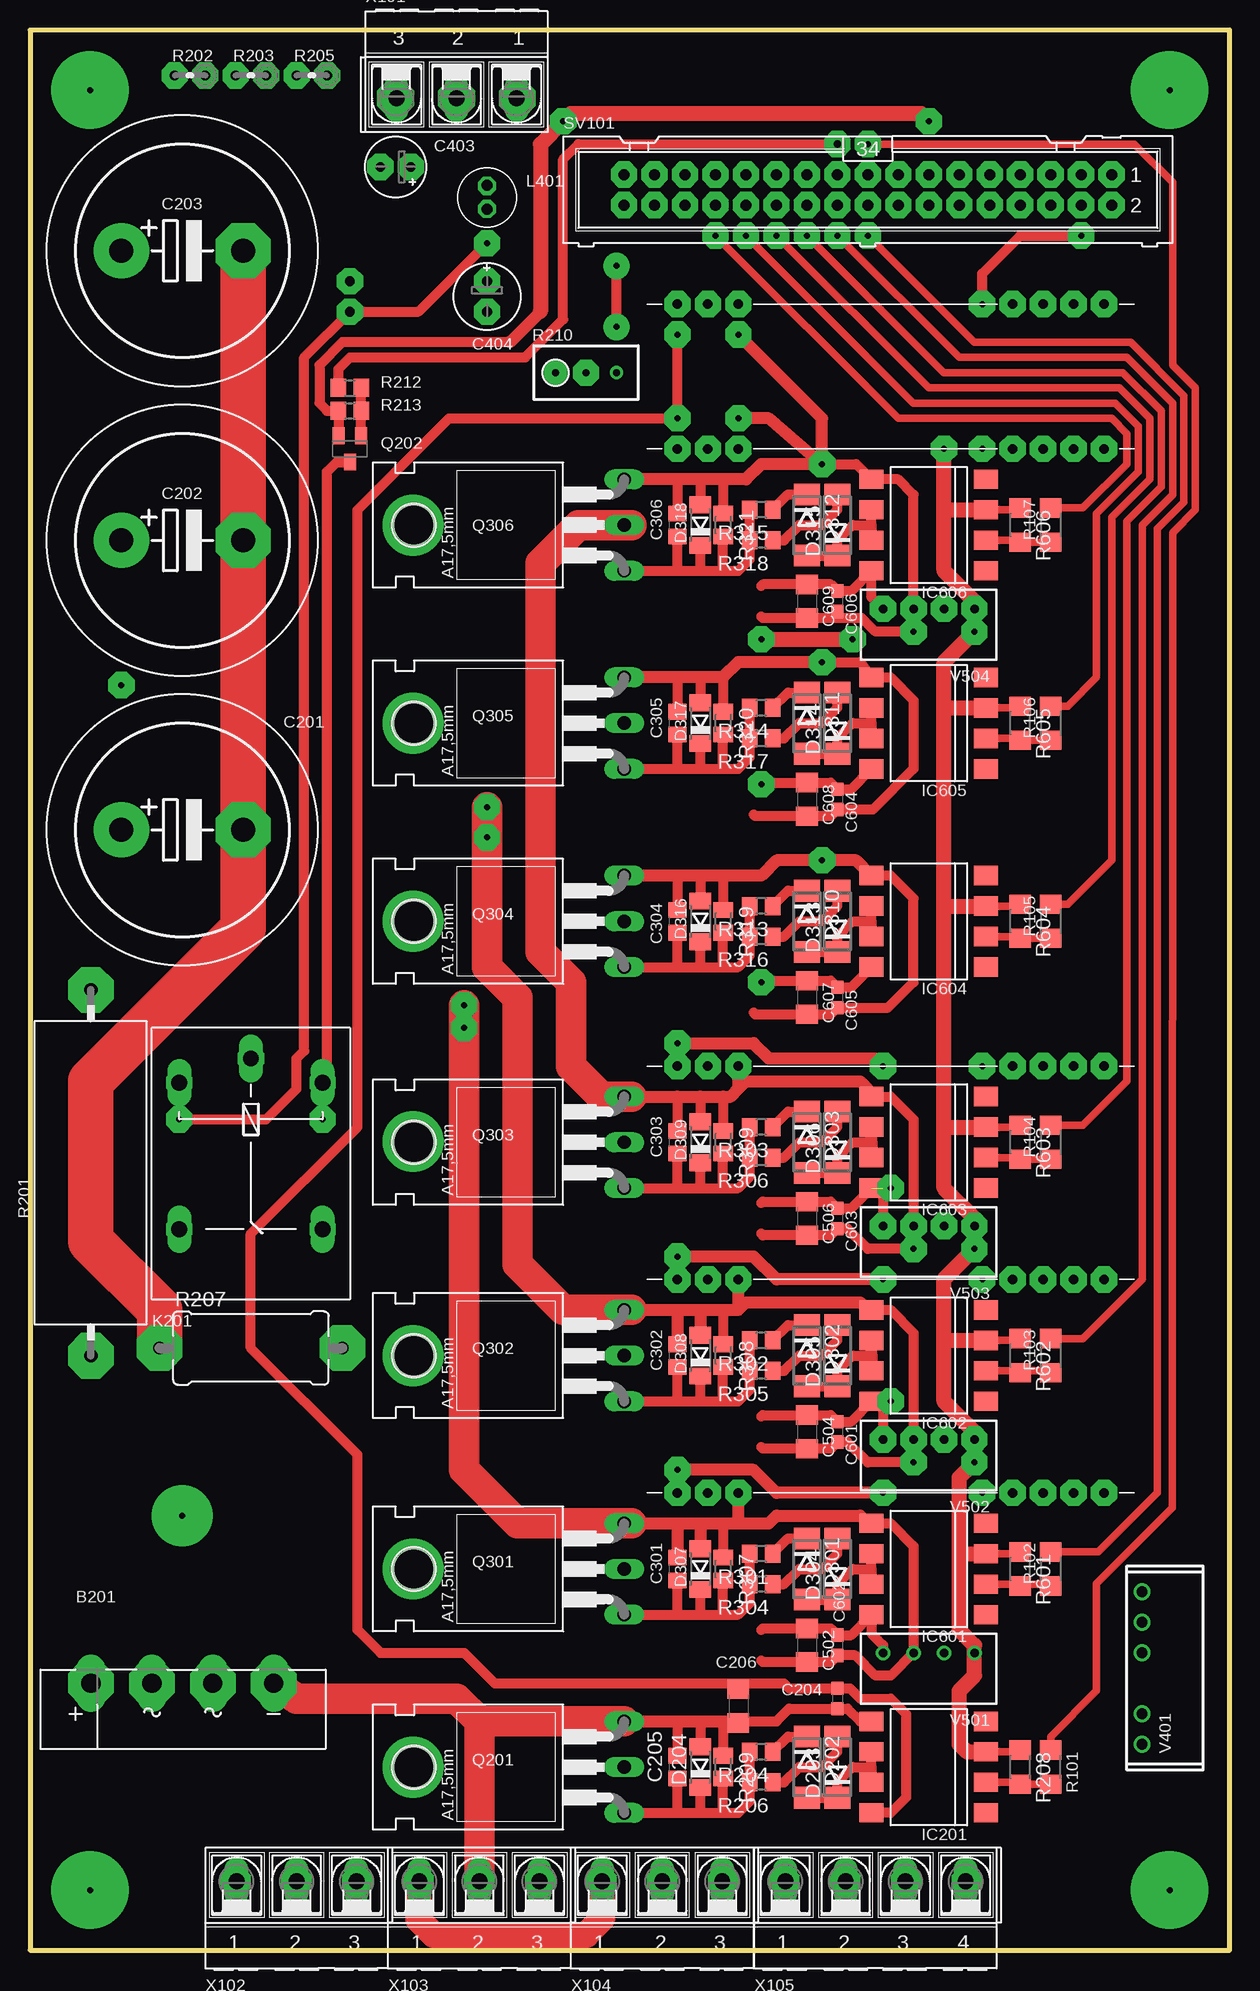
[diagram p7: board, top side]
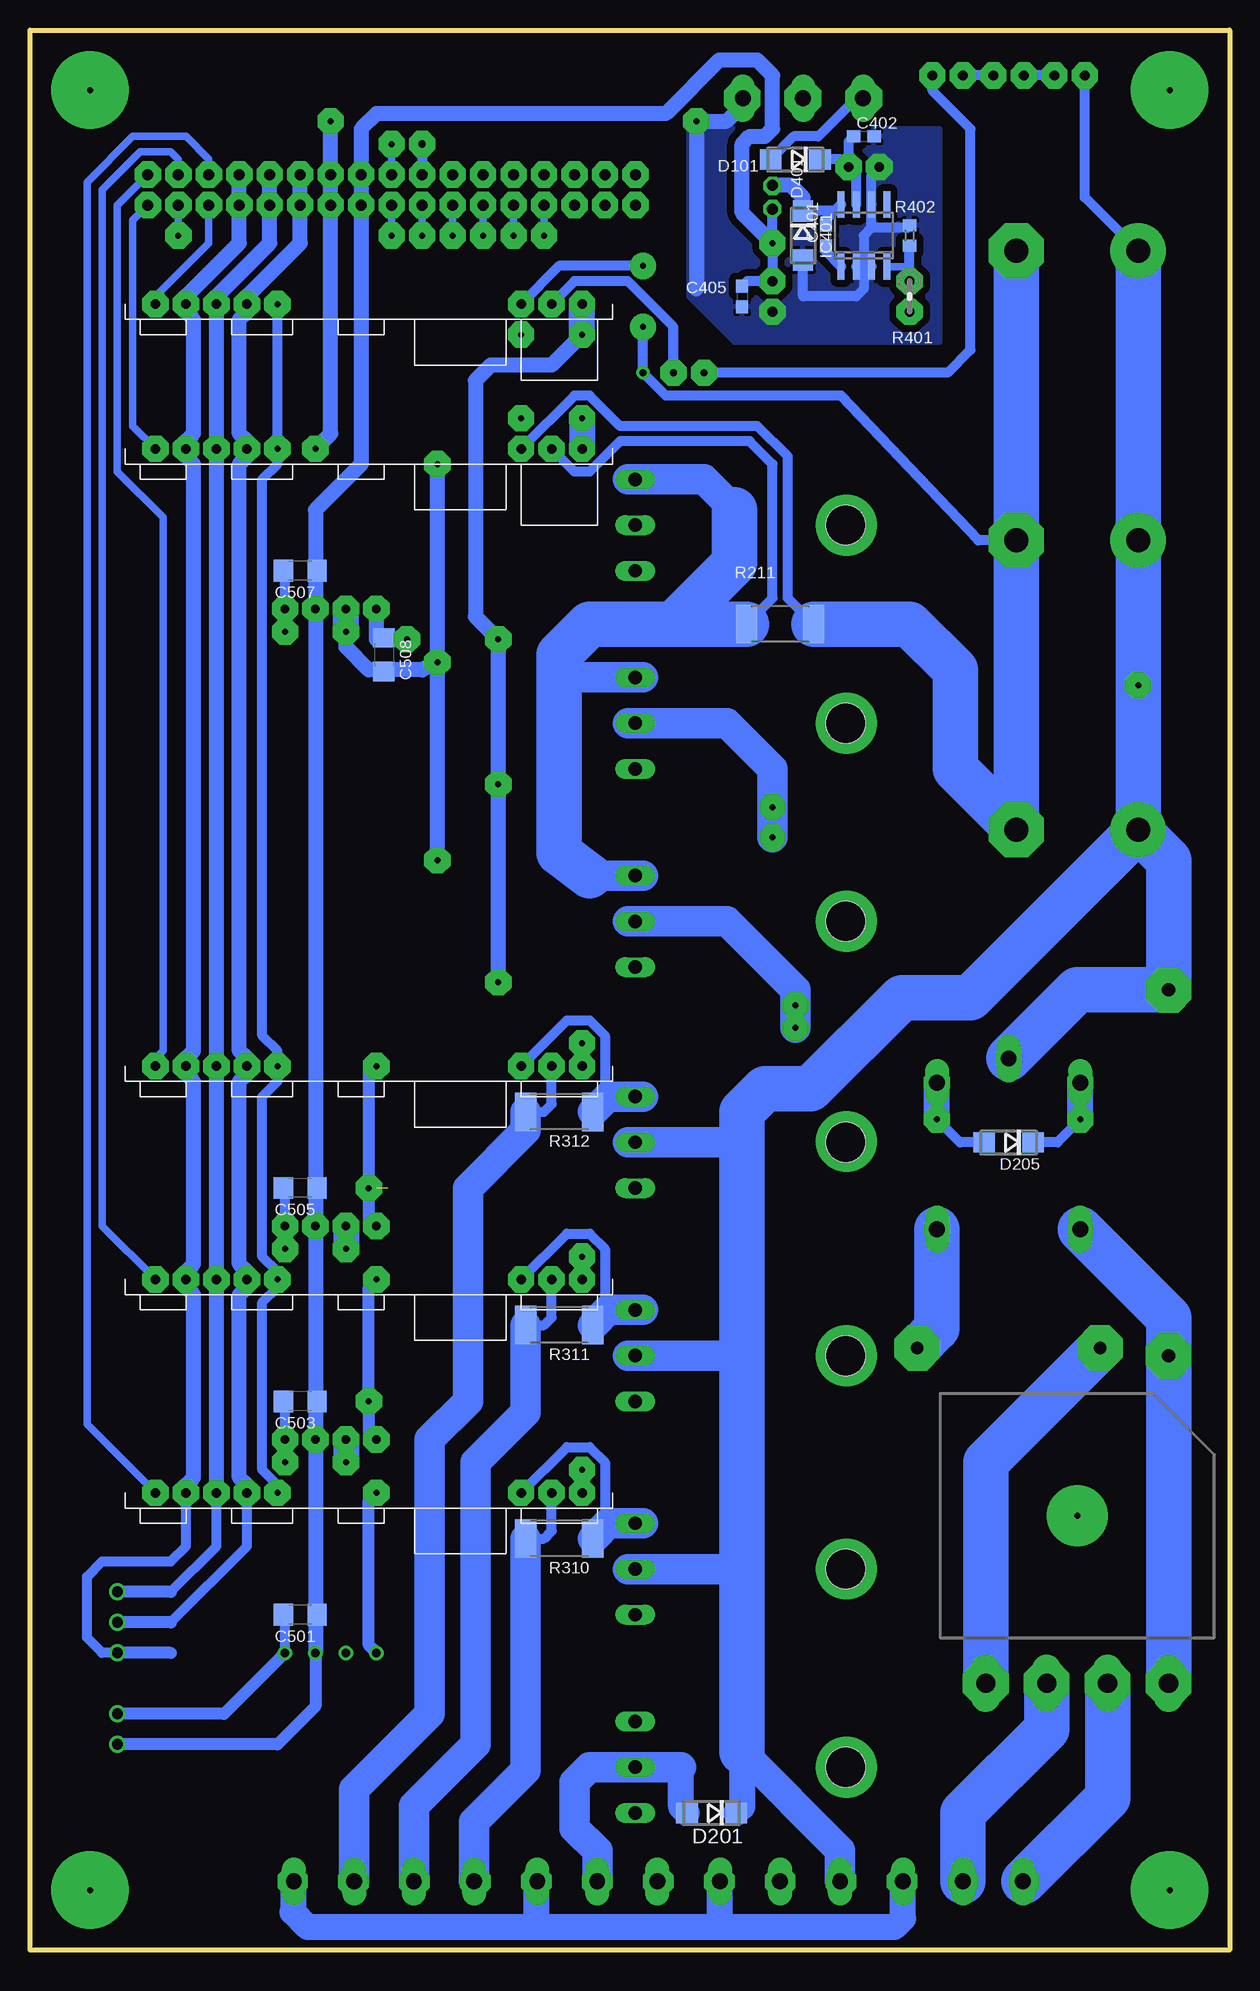
[diagram p8: board, bottom side, seen from below]

Size 100 x 160 mm. Coordinates in mm from the lower left corner, seen from the top.
Outline: 0,0 100,0 100,160 0,160 0,0
Copper layers (1*16): Top 0.035mm / dielectric 1.5mm / Bottom 0.035mm
Design rules "default": minimum track width 10mil, minimum drill 24mil, track to track 8mil, track to pad 8mil, pad to pad 8mil, via to via 8mil, smd to smd 8mil, copper to edge 40mil, drill to drill 8mil, minimum pad ring 10mil, minimum via ring 8mil, stop-mask expansion 4mil, vias tented up to drill 0mil, thermal gap 10mil

### Footprints (pad centres in the part's own frame; a part is rotated, then mirrored left to right if it is on the bottom)
KBU = drill 1.6 long: + -7.62,2.54; - 7.62,2.54; AC1 -2.54,2.54; AC2 2.54,2.54
EB22,5D = drill 2.007 pad 4.597 round: + -5.08,0 | drill 2.007 pad 4.597 octagon: - 5.08,0
C0603 = smd 1.1 x 1: 1 -0.85,0; 2 0.85,0
C0805 = smd 1.3 x 1.5: 1 -0.95,0; 2 0.95,0
C1206 = smd 1.6 x 1.8: 1 -1.4,0; 2 1.4,0
E2,5-5 = drill 0.813 pad 1.6 round: + -1.27,0 | drill 0.813 pad 1.6 octagon: - 1.27,0
E2,5-6E = drill 0.813 pad 1.575 round: + -1.27,0 | drill 0.813 pad 1.575 octagon: - 1.27,0
DO214AC = smd 1.8 x 1.7: A 2.05,0; C -2.05,0
DO214AA = smd 1.8 x 2.2: A 2.55,0; C -2.55,0
SOD80C = smd 1.4 x 1.8: A 1.7,0; C -1.7,0
CRCS.P6.02 = drill 0.8 square: 1 -12.7,0 | drill 0.8 octagon: 2 -10.16,0; 3 -7.62,0; 4 15.24,0; 5 17.78,0; 6 20.32,0; 7 22.86,0
CRCS.P11.05 = drill 0.8 square: 1 -12.7,0 | drill 0.8 octagon: 2 -10.16,0; 3 -7.62,0; 4 15.24,0; 5 17.78,0; 6 20.32,0; 7 22.86,0
DIL8-SMD = smd 1.6 x 2: 1 -3.81,-4.77; 2 -1.27,-4.77; 3 1.27,-4.77; 4 3.81,-4.77; 5 3.81,4.77; 6 1.27,4.77; 7 -1.27,4.77; 8 -3.81,4.77
SO08 = smd 0.6 x 2.2: 1 -1.905,-2.6; 2 -0.635,-2.6; 3 0.635,-2.6; 4 1.905,-2.6; 5 1.905,2.6; 6 0.635,2.6; 7 -0.635,2.6; 8 -1.905,2.6
G5LE = drill 1.321 long: 1 -7.493,-5.969; 2 -7.493,5.969; O 4.699,5.969; P -9.525,0; S 4.699,-5.969
CW45-V = drill 0.9 pad 1.422 octagon: P$1 -1,0; P$2 1,0
TO220BH-HV1 = drill 1.118 long: D 0,-6.35; G -3.81,-6.35; S 3.81,-6.35 | hole 3.302: 0,11.176
SOT23-BEC = smd 1 x 1.4: B -0.95,-1.1; C 0,1.1; E 0.95,-1.1
R1206 = smd 1.6 x 1.803: 1 -1.422,0; 2 1.422,0
VTA52 = drill 1.1 octagon: 1 -15.24,0; 2 15.24,0
0204V = drill 0.813 octagon: 1 -1.27,0; 2 1.27,0
R0805 = smd 1.3 x 1.5: 1 -0.95,0; 2 0.95,0
RDH/15 = drill 1.016 octagon: 1 -7.62,0; 2 7.62,0
M0805 = smd 1.3 x 1.6: 1 -0.95,0; 2 0.95,0
RTRIM3296W = drill 0.61 round: 1 0,-2.54; 2 0,0; 3 0,2.54
R2512 = smd 1.8 x 3.2: 1 -2.8,0; 2 2.8,0
R0603 = smd 1 x 1.1: 1 -0.85,0; 2 0.85,0
ML34 = drill 0.914 octagon: 1 -20.32,-1.27; 2 -20.32,1.27; 3 -17.78,-1.27; 4 -17.78,1.27; 5 -15.24,-1.27; 6 -15.24,1.27; 7 -12.7,-1.27; 8 -12.7,1.27; 9 -10.16,-1.27; 10 -10.16,1.27; 11 -7.62,-1.27; 12 -7.62,1.27; 13 -5.08,-1.27; 14 -5.08,1.27; 15 -2.54,-1.27; 16 -2.54,1.27; 17 0,-1.27; 18 0,1.27; 19 2.54,-1.27; 20 2.54,1.27; 21 5.08,-1.27; 22 5.08,1.27; 23 7.62,-1.27; 24 7.62,1.27; 25 10.16,-1.27; 26 10.16,1.27; 27 12.7,-1.27; 28 12.7,1.27; 29 15.24,-1.27; 30 15.24,1.27; 31 17.78,-1.27; 32 17.78,1.27; 33 20.32,-1.27; 34 20.32,1.27
TMA_DUAL = drill 0.9 round: 1 -5.08,0; 2 -2.54,0; 5 2.54,0; 6 5.08,0; 7 7.62,0
TME = drill 0.7 pad 1.1 round: 1 -3.81,0; 2 -1.27,0; 3 1.27,0; 4 3.81,0
AK500/3-H = drill 1.321 long: 1 -5.004,0; 2 0,0; 3 5.004,0
AK500/4-H = drill 1.321 long: 1 -7.518,0; 2 -2.489,0; 3 2.489,0; 4 7.518,0

### Placement (x,y rotation side)
B201  12.7,19.68 0 top
C201  12.7,93.34 0 top
C202  12.7,117.47 0 top
C203  12.7,141.6 0 top
C204  67.31,20.95 270 top
C205  53.98,15.24 90 top
C206  59.05,20.32 270 top
C301  53.98,31.75 90 top
C302  53.98,49.53 90 top
C303  53.98,67.31 90 top
C304  53.98,85.72 90 top
C305  53.98,102.23 90 top
C306  53.98,118.75 90 top
C401  33.66,142.88 90 bottom
C402  30.48,151.13 0 bottom
C403  30.48,148.59 180 top
C404  38.1,137.79 270 top
C405  40.64,137.79 270 bottom
C501  77.47,27.94 180 bottom
C502  64.77,25.4 270 top
C503  77.47,45.72 180 bottom
C504  64.77,43.18 270 top
C505  77.47,63.5 180 bottom
C506  64.77,60.96 270 top
C507  77.47,114.94 180 bottom
C508  70.48,107.95 270 bottom
C601  67.31,43.18 270 top
C602  67.31,25.4 270 top
C603  67.31,60.96 270 top
C604  67.31,95.89 270 top
C605  67.31,79.38 270 top
C606  67.31,112.39 270 top
C607  64.77,79.38 270 top
C608  64.77,95.89 270 top
C609  64.77,112.39 270 top
D101  36.2,149.22 180 bottom
D201  43.18,11.43 180 bottom
D202  64.77,15.24 270 top
D203  67.31,15.24 90 top
D204  55.88,15.24 90 top
D205  18.41,67.31 180 bottom
D301  64.77,31.75 270 top
D302  64.77,49.53 270 top
D303  64.77,67.31 270 top
D304  67.31,31.75 90 top
D305  67.31,49.53 90 top
D306  67.31,67.31 90 top
D307  55.88,31.75 90 top
D308  55.88,49.53 90 top
D309  55.88,67.31 90 top
D310  64.77,85.72 270 top
D311  64.77,102.23 270 top
D312  64.77,118.75 270 top
D313  67.31,85.72 90 top
D314  67.31,102.23 90 top
D315  67.31,118.75 90 top
D316  55.88,85.72 90 top
D317  55.88,102.23 90 top
D318  55.88,118.75 90 top
D401  35.56,142.88 270 bottom
HIC701  66.67,38.1 0 top
HIC702  66.67,55.88 0 top
HIC703  66.67,73.66 0 top
HIC704  66.67,125.09 0 top
HIC705  66.67,137.16 0 top
IC201  74.93,15.24 90 top
IC401  30.48,142.88 0 bottom
IC601  74.93,31.75 90 top
IC602  74.93,49.53 90 top
IC603  74.93,67.31 90 top
IC604  74.93,85.72 90 top
IC605  74.93,102.23 90 top
IC606  74.93,118.75 90 top
K201  18.41,64.77 270 top
L401  38.1,146.05 270 top
Q201  43.18,15.24 90 top
Q202  26.67,125.09 180 top
Q301  43.18,31.75 90 top
Q302  43.18,49.53 90 top
Q303  43.18,67.31 90 top
Q304  43.18,85.72 90 top
Q305  43.18,102.23 90 top
Q306  43.18,118.75 90 top
R101  85.09,15.24 270 top
R102  85.09,31.75 90 top
R103  85.09,49.53 90 top
R104  85.09,67.31 90 top
R105  85.09,85.72 90 top
R106  85.09,102.23 90 top
R107  85.09,118.75 90 top
R201  5.08,64.77 90 top
R202  13.34,156.21 180 top
R203  18.41,156.21 180 top
R204  60.96,16.51 180 top
R205  23.5,156.21 180 top
R206  60.96,13.97 180 top
R207  18.41,50.16 0 top
R208  82.55,15.24 270 top
R209  57.78,15.24 270 top
R210  46.35,131.44 270 top
R211  37.47,110.49 180 bottom
R212  26.67,130.18 0 top
R213  26.67,128.27 0 top
R301  60.96,33.02 180 top
R302  60.96,50.8 180 top
R303  60.96,68.58 180 top
R304  60.96,30.48 180 top
R305  60.96,48.26 180 top
R306  60.96,66.04 180 top
R307  57.78,31.75 270 top
R308  57.78,49.53 270 top
R309  57.78,67.31 270 top
R310  55.88,34.29 180 bottom
R311  55.88,52.07 180 bottom
R312  55.88,69.85 180 bottom
R313  60.96,87 180 top
R314  60.96,103.5 180 top
R315  60.96,120.02 180 top
R316  60.96,84.45 180 top
R317  60.96,100.97 180 top
R318  60.96,117.47 180 top
R319  57.78,85.72 270 top
R320  57.78,102.23 270 top
R321  57.78,118.75 270 top
R401  26.67,137.79 270 bottom
R402  26.67,142.88 270 bottom
R601  82.55,31.75 270 top
R602  82.55,49.53 270 top
R603  82.55,67.31 270 top
R604  82.55,85.72 270 top
R605  82.55,102.23 270 top
R606  82.55,118.75 270 top
SV101  69.85,146.69 180 top
V401  92.71,22.23 90 top
V501  74.93,24.77 180 top
V502  74.93,42.55 180 top
V503  74.93,60.33 180 top
V504  74.93,111.76 180 top
X101  35.56,154.31 180 top
X102  22.23,5.71 0 top
X103  37.47,5.71 0 top
X104  52.7,5.71 0 top
X105  70.48,5.71 0 top

### Tracks (layer width: path | path; a pad name or v marks a point on that pad's centre or on a via)
24V_AUX  (via drill 0.5 pad 2.18)
  Bottom 0.813: IC401.7 31.11,147.96 C403.+ | C403.+ 31.75,150.71 C402.1 | D101.C 32.38,149.22 C403.+
  other vias: 31.75,148.59
+12V_OR_+5V  (via drill 0.5 pad 1.52, 0.5 pad 2.18)
  Top 0.813: v12.45,69.22 19.68,69.22 22.23,71.75 22.23,74.3 22.86,74.93 22.86,132.72 v26.67,136.53 32.38,136.53 v38.1,142.24
  Bottom 0.813: D205.C 14.35,67.31 v12.45,69.22 | C405.1 40.22,139.06 C404.+ v38.1,142.24 v38.1,145.1 L401.P$2 | 76.2,114.94 C507.1 | 76.2,63.5 C505.1 | 76.2,45.72 C503.1 | 76.2,27.94 C501.1
  Bottom 1.016: V401.1 79.38,17.14 76.2,20.32 V501.2
  Bottom 1.27: V501.2 76.2,27.94 V502.2 76.2,45.72 V503.2 76.2,63.5 V504.2 76.2,114.94 76.2,120.02 72.39,123.83 SV101.16 SV101.15 72.39,151.76 71.12,153.03 46.99,153.03 42.55,157.48 39.37,157.48 38.1,156.21 38.1,151.76 38.73,151.13 40.01,151.13 40.64,150.5 40.64,144.78 v38.1,142.24
  Bottom 2.184: v12.45,69.22 K201.1
  other vias: 12.45,72.26 76.2,60.33 76.2,42.55 76.2,111.76 72.39,145.41 72.39,147.96 38.1,139.06
+15V  (via drill 0.5 pad 2.18)
  Bottom 0.813: 88.27,29.84 84.45,33.66 HIC701.5
  Bottom 1.016: 88.27,29.84 V401.7
  Bottom 1.27: HIC701.5 HIC702.5 HIC703.5 HIC704.5 HIC705.5 84.45,137.79 80.01,142.24 SV101.10 SV101.9
  other vias: 84.45,38.1 84.45,55.88 84.45,73.66 84.45,125.09 84.45,137.16 80.01,147.96 80.01,145.41
+15V_G1  (via drill 0.5 pad 2.18)
  Top 0.813: 60.96,26.67 61.09,26.8 C502.1 66.76,26.8 C602.1 68.47,26.25 IC601.8 70.16,26.36 71.12,25.4 V501.4
  Top 1.016: v53.98,38.1 v53.98,40.01 60.33,40.01 62.23,38.1 v71.12,38.1
  Bottom 1.016: v71.12,38.1 71.75,37.47 71.75,25.4 V501.4
+15V_G2  (via drill 0.5 pad 2.18)
  Top 0.813: 71.12,45.72 v71.75,45.72 | 71.12,45.72 V502.4 | 71.12,45.72 IC602.8 68.47,44.03 C601.1 66.76,44.58 C504.1 61.09,44.58 60.96,44.45
  Top 1.016: v53.98,55.88 v53.98,57.78 60.33,57.78 62.23,55.88 v71.12,55.88
  Bottom 1.016: v71.12,55.88 71.75,55.24 v71.75,45.72 71.75,43.18 V502.4
  other vias: 71.12,42.55
+15V_G3  (via drill 0.5 pad 2.18)  (1 unrouted)
  Top 0.813: v71.75,63.5 71.12,63.5 V503.4 | 60.96,62.23 61.09,62.36 C506.1 66.76,62.36 C603.1 68.47,61.81 IC603.8
  Top 1.016: v53.98,73.66 v53.98,75.56 60.33,75.56 61.59,74.3 70.48,74.3 v71.12,73.66
  Bottom 1.016: v71.12,73.66 71.75,73.03 v71.75,63.5 71.75,60.96 V503.4 | v53.98,73.66 v53.98,75.56
  other vias: 71.12,60.33
+15V_G456  (via drill 0.5 pad 2.18)
  Top 0.813: IC606.8 | IC606.8 | IC201.8 71.75,11.43 73.03,12.7 73.03,19.68 71.75,20.95 69.22,20.95 68.36,21.8 C204.1 63.28,21.8 62.87,22.23 59.05,22.23 | V504.4 70.16,112.72 IC606.8 | 60.96,113.67 61.09,113.8 C609.1 66.76,113.8 C606.1 68.47,113.25 IC606.8 | 59.05,22.23 38.73,22.23 36.2,24.77 29.21,24.77 27.3,26.67 27.3,41.27 18.41,50.16 18.41,59.69 27.3,68.58 27.3,120.02 34.92,127.64 v53.98,127.64 v53.98,134.62 | 59.05,22.23 C206.1 | IC604.8 68.47,80.22 C605.1 66.76,80.78 C607.1 60.96,80.78 | 60.96,80.78 60.45,80.78 60.33,80.64 | v60.96,80.64 60.96,80.78 | 60.96,97.28 60.45,97.28 60.33,97.16 | 60.96,97.28 C608.1 66.76,97.28 C604.1 68.47,96.73 IC605.8 | v60.96,97.16 60.96,97.28
  Top 1.27: v60.96,109.22 v68.58,109.22
  Bottom 0.813: 71.12,109.22 C508.1
  Bottom 1.27: v53.98,134.62 56.52,132.08 61.59,132.08 62.87,130.81 62.87,111.12 v60.96,109.22 v60.96,97.16 v60.96,80.64 | v68.58,109.22 71.12,109.22 V504.4
  Bottom 2.184: v53.98,127.64 v53.98,125.09 | v53.98,134.62 v53.98,137.16
  other vias: 71.12,111.76
-15V  (via drill 0.5 pad 2.18)
  Bottom 0.813: HIC701.6 87,33.66 88.27,32.38 93.98,32.38 95.25,31.11 95.25,26.04 93.98,24.77 V401.5
  Bottom 1.016: 88.27,24.77 V401.5
  Bottom 1.27: HIC701.6 87,38.73 86.36,39.37 86.36,54.61 87,55.24 HIC702.6 87,56.52 86.36,57.15 86.36,72.39 87,73.03 HIC703.6 87,74.3 86.36,74.93 86.36,123.83 87,124.46 HIC704.6 87,125.73 86.36,126.36 86.36,135.89 87,136.53 HIC705.6 87,137.79 82.55,142.24 SV101.8 SV101.7
  other vias: 87,38.1 87,55.88 87,73.66 87,125.09 87,137.16 82.55,145.41 82.55,147.96
AGND  (via drill 0.5 pad 2.18)
  Bottom 0.813: v81.92,38.1 81.92,33.66 88.27,27.3
  Bottom 1.016: 88.27,27.3 V401.6
  Bottom 1.27: v81.92,38.1 81.92,38.73 82.55,39.37 82.55,54.61 81.92,55.24 v81.92,55.88 81.92,56.52 82.55,57.15 82.55,72.39 81.92,73.03 v81.92,73.66 81.92,74.3 82.55,74.93 82.55,123.83 81.92,124.46 v81.92,125.09 81.92,125.73 82.55,126.36 82.55,135.89 81.92,136.53 v81.92,137.16 81.92,137.79 77.47,142.24 SV101.12 SV101.11
  other vias: 77.47,145.41 77.47,147.96
BR_R  (via drill 0.5 pad 2.18)
  Top 0.61: v69.85,150.5 92.08,150.5 95.25,147.32 95.25,132.08 97.16,130.18 97.16,120.02 95.25,118.11 95.23,36.84 88.9,30.5 88.9,21.59 85.09,17.78 R101.1
  Bottom 0.61: v69.85,150.5 SV101.17
  other vias: 69.85,147.96
BR_RESISTOR
  Top 0.61: R101.2 R208.2 82.4,13.97 IC201.2
BRIDGE_U  (via drill 0.5 pad 2.18)
  Top 0.813: IC601.5 71.75,35.56 73.66,33.66 V501.3 71.75,22.86 70.48,22.86 68.8,24.55 C602.2 66.76,24 C502.2 61.09,24 60.96,24.13 | 57.78,35.56 R307.1
  Top 1.016: Q301.S 53.98,35.56 | 53.98,35.56 55.88,35.56 | 55.88,35.56 57.78,35.56 59.05,35.56 | 59.05,35.56 HIC701.3 | 53.98,35.56 C301.2 | 55.88,35.56 D307.A | 59.05,35.56 61.59,35.56 62.23,36.2 69.22,36.2 69.85,35.56 IC601.5
  Top 2.54: v36.2,78.74 v36.2,76.83 36.2,40.01 40.64,35.56 50.16,35.56 Q301.S
  Bottom 0.813: HIC701.3 55.24,41.91 53.34,41.91 52.07,40.64 52.07,35.56 53.34,34.29
  Bottom 2.54: 50.16,85.72 Q304.D 41.91,85.72 36.2,80.01 v36.2,78.74 v36.2,76.83 | Q301.S 48.9,35.56 51.81,35.56 R310.1
  other vias: 59.05,38.1
BRIDGE_V  (via drill 0.5 pad 2.18)
  Top 0.813: V502.3 73.66,51.44 71.75,53.34 IC602.5 | 60.96,41.91 61.09,41.78 C504.2 66.76,41.78 C601.2 68.16,42.33 69.85,40.64 v73.66,40.64 | 57.78,53.34 R308.1
  Top 1.016: 55.88,53.34 57.78,53.34 59.05,53.34 | 59.05,53.34 HIC702.3 | 55.88,53.34 D308.A | 59.05,53.34 59.69,53.98 69.22,53.98 69.85,53.34 IC602.5 | 53.98,53.34 55.88,53.34 | 53.98,53.34 C302.2 | Q302.S 53.98,53.34
  Top 2.54: v38.1,95.25 v38.1,92.71 38.1,81.92 40.64,79.38 40.64,57.15 44.45,53.34 Q302.S 50.16,53.34
  Bottom 0.813: HIC702.3 55.24,59.69 53.34,59.69 52.07,58.42 52.07,53.34 53.34,52.07
  Bottom 2.184: V502.3 v73.66,40.64
  Bottom 2.54: v38.1,92.71 v38.1,95.25 38.1,98.42 41.91,102.23 Q305.D 50.16,102.23 | 48.9,53.34 Q302.S 51.81,53.34 R311.1
  other vias: 73.66,42.55 59.05,55.88
BRIDGE_W  (via drill 0.5 pad 2.18)
  Top 0.813: V503.3 73.66,69.22 71.75,71.12 IC603.5 | 60.96,59.69 61.09,59.56 C506.2 66.76,59.56 C603.2 68.16,60.11 69.85,58.42 v73.66,58.42 | 53.98,71.12 C303.2 | 55.88,71.12 D309.A | 57.78,71.12 R309.1
  Top 1.016: Q303.S 53.98,71.12 55.88,71.12 57.78,71.12 58.42,71.12 59.05,71.75 | 59.05,71.75 59.69,72.39 69.22,72.39 69.85,71.75 69.85,71.12 IC603.5 | 59.05,71.75 HIC703.3
  Top 2.54: 50.16,118.75 Q306.D 45.72,118.75 42.55,115.57 42.55,83.19 45.09,80.64 45.09,73.66 47.62,71.12 Q303.S 50.16,71.12
  Bottom 0.813: HIC703.3 55.24,77.47 53.34,77.47 52.07,76.2 52.07,71.12 53.34,69.85
  Bottom 2.184: V503.3 v73.66,58.42
  Bottom 2.54: 48.9,71.12 Q303.S 51.81,71.12 R312.1
  other vias: 73.66,60.33 59.05,73.66
CAP_DC-  (via drill 0.5 pad 2.18, 0.5 pad 2.54, 0.5 pad 3.81)
  Top 0.813: v48.9,135.25 v48.9,140.34 | IC201.5 69.22,19.05 68.16,20.11 C204.2 63.28,20.11 62.23,19.05 59.05,19.05 C206.2 | 53.98,19.05 C205.2 | 55.88,19.05 D204.A | 57.78,19.05 R209.1
  Top 1.016: Q201.S 53.98,19.05 55.88,19.05 57.78,19.05 59.05,19.05
  Top 2.54: X103.2 37.47,19.05 | 37.47,19.05 35.56,20.95 22.23,20.95 v20.32,22.23 | 37.47,19.05 Q201.S
  Top 3.81: C203.- C201.- 17.78,85.09 5.08,72.39 5.08,59.05 10.79,53.34 R207.1
  Bottom 0.813: R211.1 36.83,112.66 36.83,124.46 39.37,127 50.8,127 53.34,129.54 54.61,129.54 HIC704.3 | C202.- 20.95,117.47 32.38,129.54 46.99,129.54 R210.3 v48.9,135.25 | HIC705.3 55.88,140.34 v48.9,140.34
  Bottom 3.81: C203.- C202.- C201.- 22.86,98.42 22.86,106.68 26.67,110.49 R211.1 | v20.32,22.23 20.32,40.64 R207.1
  other vias: 37.47,5.71 17.78,93.34 17.78,117.47 17.78,141.6 10.79,50.16 59.05,137.16 59.05,125.09
CHARGE_RELAY  (via drill 0.5 pad 2.18, 0.6 pad 2.18)
  Top 0.813: R212.1 25.72,131.76 26.67,132.72 41.27,132.72 44.45,135.89 44.45,149.22 45.72,150.5 v67.31,150.5
  Bottom 0.813: v67.31,150.5 SV101.19
  other vias: 67.31,147.96
CURRENT_A  (via drill 0.5 pad 2.18)
  Bottom 0.61: HIC701.7 95.25,43.81 95.25,147.32 91.44,151.13 87,151.13 85.09,149.22 SV101.5
  other vias: 89.53,38.1 85.09,147.96
CURRENT_B  (via drill 0.5 pad 2.18)
  Bottom 0.61: HIC702.7 93.98,60.33 93.98,146.69 90.81,149.86 88.27,149.86 87.63,149.22 SV101.3
  other vias: 89.53,55.88 87.63,147.96
CURRENT_C  (via drill 0.5 pad 2.18)
  Bottom 0.61: HIC703.7 89.53,74.3 88.9,74.93 88.9,119.38 92.71,123.19 92.71,145.41 SV101.1
  other vias: 89.53,73.66 90.17,147.96
CURRENT_MOTOR  (via drill 0.5 pad 2.18)
  Bottom 0.61: HIC704.7 91.44,127 91.44,144.15 SV101.2
  other vias: 89.53,125.09 90.17,145.41
DC+  (via drill 0.5 pad 2.18, 0.5 pad 2.54, 0.5 pad 3.81)
  Top 2.184: X104.1 47.7,2.62 46.35,1.27 33.66,1.27 32.38,2.54 32.38,5.64 X103.1
  Bottom 0.406: X103.1 v32.38,5.71 | X104.1 v47.62,5.71
  Bottom 0.813: C203.+ 12.06,146.05 v12.06,156.21
  Bottom 2.184: Q303.D 48.9,67.31 | 40.64,16.51 40.64,11.92 D201.C
  Bottom 2.54: X103.1 32.46,8.33 40.64,16.51 | 40.64,65.41 40.64,67.31 Q303.D 50.16,67.31 | 40.64,49.53 Q302.D 50.16,49.53 | 50.16,31.75 Q301.D 40.64,31.75
  Bottom 3.81: K201.P 12.7,80.01 R201.2 5.08,90.81 C201.+ | C201.+ v7.62,105.41 C202.+ C203.+ | 40.64,16.51 40.64,31.75 40.64,49.53 40.64,65.41 40.64,69.85 38.73,71.75 34.92,71.75 27.3,79.38 21.59,79.38 C201.+
  other vias: 5.08,80.01 18.41,74.3 7.62,93.34 7.62,117.47 7.62,141.6
DC-  (via drill 0.5 pad 2.18)
  Top 0.813: IC604.5 71.75,89.53 73.66,87.63 73.66,80.64 71.54,78.53 C605.2 66.76,77.97 C607.2 60.45,77.97 60.33,78.11 | v66.04,107.31 69.22,107.31 IC605.5 71.75,106.05 73.66,104.14 73.66,98.42 70.27,95.03 C604.2 66.76,94.48 C608.2 60.45,94.48 60.33,94.61 | v66.04,123.83 68.89,123.83 IC606.5 | V504.3 73.66,121.28 72.39,122.56 70.48,122.56 | 53.98,122.56 C306.2 | 55.88,122.56 D318.A | 57.78,122.56 R321.1 | 53.98,106.05 C305.2 | 55.88,106.05 D317.A | 57.78,106.05 R320.1 | 53.98,89.53 C304.2 | 55.88,89.53 D316.A | 57.78,89.53 R319.1 | 60.96,111.12 61.09,111 C609.2 67.31,111 | 67.31,111 69.34,111 70.48,109.86 v73.66,109.86 | 67.31,111 C606.2
  Top 1.016: v59.05,127.64 61.59,127.64 v66.04,123.83 | v66.04,123.83 66.04,127.64 v59.05,134.62 | Q304.S 53.98,89.53 55.88,89.53 57.78,89.53 60.96,89.53 62.23,90.81 v66.04,90.81 68.89,90.81 IC604.5 | Q305.S 53.98,106.05 55.88,106.05 57.78,106.05 59.05,107.31 v66.04,107.31 | Q306.S 53.98,122.56 55.88,122.56 57.78,122.56 59.69,122.56 60.96,123.83 v66.04,123.83
  Bottom 0.61: 67.31,106.68 C508.2
  Bottom 0.813: R211.2 38.1,112.66 38.1,123.83 40.01,125.73 50.8,125.73 53.34,123.19 54.61,123.19 HIC704.2
  Bottom 1.27: v66.04,107.31 v66.04,123.83 | v66.04,90.81 v66.04,107.31 | v73.66,109.86 73.66,108.58 71.75,106.68 67.31,106.68 v66.04,107.31
  Bottom 2.184: v73.66,109.86 V504.3
  Bottom 2.54: 48.9,106.05 Q305.S 55.88,106.05 | 48.9,89.53 Q304.S 53.34,89.53 | Q306.S 45.72,122.56 | Q306.S 50.16,122.56 | Q306.S 43.81,122.56 41.27,120.02
  Bottom 3.81: 53.34,89.53 55.88,91.44 55.88,107.95 53.34,110.49 46.35,110.49 | 41.27,120.02 41.27,115.57 46.35,110.49 | 46.35,110.49 R211.2
  other vias: 73.66,111.76 56.52,125.09
G1
  Top 0.813: 70.16,31.75 IC601.7 | 70.16,31.75 IC601.6 | 70.16,31.75 68.58,31.75 67.31,30.48 D304.C D301.A
G2
  Top 0.813: 70.16,85.72 IC604.7 | 70.16,85.72 IC604.6 | 70.16,85.72 68.58,85.72 67.31,84.45 D313.C D310.A
G3
  Top 0.813: 70.16,49.53 68.58,49.53 67.31,48.26 D305.C D302.A
  Top 1.016: IC602.7 70.16,49.53 IC602.6
G4
  Top 0.813: 70.16,102.23 IC605.7 | 70.16,102.23 IC605.6 | D311.A D314.C 67.31,100.97 68.58,102.23 70.16,102.23
G5
  Top 0.813: D303.A D306.C 67.31,66.04 68.58,67.31 70.16,67.31
  Top 1.016: IC603.7 70.16,67.31 IC603.6
G6
  Top 0.813: 70.16,118.75 IC606.7 | 70.16,118.75 IC606.6 | D312.A D315.C 67.31,117.47 68.58,118.75 70.16,118.75
GND  (via drill 0.5 pad 2.18, 0.5 pad 3.05)
  Top 0.61: IC605.3 82.55,103.5 R605.1 | IC604.3 82.55,87 R604.1 | IC603.3 82.55,68.58 R603.1 | IC601.3 82.55,33.02 R601.1 | IC602.3 82.55,50.8 R602.1 | IC606.3 82.55,120.02 R606.1 | IC201.3 82.4,16.51 R208.1
  Top 0.813: Q202.E R213.1 24.77,128.27 24.13,128.91 24.13,132.08 26.04,133.99 40.01,133.99
  Top 1.016: 42.55,136.53 40.01,133.99
  Top 1.27: 77.47,33.02 77.47,26.67 78.74,25.4 V501.1 78.74,22.86 77.47,21.59 77.47,17.14 78.11,16.51 IC201.3 | 77.47,33.02 77.47,39.37 v78.74,40.64 V502.1 78.74,43.18 76.2,45.72 76.2,50.8 | 77.47,33.02 IC601.3 | 76.2,68.58 76.2,63.5 78.74,60.96 V503.1 v78.74,58.42 76.2,55.88 76.2,50.8 | 76.2,68.58 IC603.3 | 76.2,68.58 76.2,87 | 76.2,87 76.2,103.5 | 76.2,103.5 76.2,107.31 v78.74,109.86 V504.1 78.74,112.39 76.2,114.94 76.2,120.02 | 76.2,50.8 IC602.3 | 76.2,87 IC604.3 | 76.2,103.5 IC605.3 | 76.2,120.02 v76.2,125.09 | 76.2,120.02 IC606.3 | v74.93,152.4 74.3,153.03 45.09,153.03 v44.45,152.4 42.55,150.5 42.55,136.53
  Bottom 0.813: 29.84,143.51 IC401.6 29.84,147.96 C403.- | 29.84,143.51 30.48,142.88 30.48,140.28 | 30.48,140.28 IC401.2 30.48,139.64 30.48,138.43 31.11,137.79 35.56,137.79 D401.A | 30.48,140.28 IC401.3 | 29.84,143.51 26.89,143.51 R402.1 | v40.64,154.31 X101.1 | C507.2 78.74,114.81 V504.1 | C505.2 78.74,63.37 V503.1 | C503.2 78.74,45.59 V502.1 | C501.2 78.74,27.81 V501.1
  Bottom 1.016: V401.2 83.82,19.68 V501.1
  Bottom 1.27: v76.2,125.09 74.93,126.36 SV101.14 SV101.13 v74.93,152.4 | 44.45,138.43 v44.45,152.4 41.91,152.4 40.64,153.67 v40.64,154.31
  other vias: 78.74,60.33 78.74,42.55 78.74,111.76 74.93,147.96 74.93,145.41 38.1,136.53 29.21,148.59
  pour Bottom (isolate 0.61): 24.13,133.99 24.13,151.76 45.09,151.76 45.09,137.79 41.27,133.99
HV_VBUS  (via drill 0.5 pad 2.18)
  Bottom 0.813: R210.2 46.35,135.25 50.16,139.06 54.61,139.06 HIC705.2
  other vias: 46.35,131.44 56.52,137.16
L  (via drill 0.5 pad 2.54, 0.5 pad 3.81)
  Bottom 0.406: X102.1 v17.14,5.71
  Bottom 3.81: v10.16,22.23 10.16,12.7 v17.14,5.71
MCU_G1
  Top 0.61: 82.55,30.48 IC601.2 | R601.2 82.55,30.48 | 82.55,30.48 85.09,30.48 R102.1
MCU_G2
  Top 0.61: IC604.2 82.55,84.45 R604.2 R105.1
MCU_G3
  Top 0.61: 82.55,48.26 IC602.2 | R602.2 82.55,48.26 | 82.55,48.26 85.09,48.26 R103.1
MCU_G4
  Top 0.61: IC605.2 82.55,100.97 R605.2 R106.1
MCU_G5
  Top 0.61: IC603.2 82.55,66.04 R603.2 R104.1
MCU_G6
  Top 0.61: IC606.2 82.55,117.47 R606.2 R107.1
MOTOR_U  (via drill 0.5 pad 2.18, 0.5 pad 2.54)
  Bottom 0.406: X105.1 v62.87,5.71
  Bottom 0.813: HIC701.2 56.52,34.92 57.15,34.29 R310.2
  Bottom 2.54: X105.1 62.97,10.69 58.68,14.98 R310.2
  other vias: 56.52,38.1
MOTOR_V  (via drill 0.5 pad 2.18, 0.5 pad 2.54)
  Bottom 0.406: X105.2 v67.94,5.71
  Bottom 0.813: HIC702.2 56.52,52.7 57.15,52.07 R311.2
  Bottom 2.54: X105.2 68,12.01 62.87,17.14 62.87,40.64 58.68,44.83 R311.2
  other vias: 56.52,55.88
MOTOR_W  (via drill 0.5 pad 2.18, 0.5 pad 2.54)
  Bottom 0.406: X105.3 v73.03,5.71
  Bottom 0.813: HIC703.2 56.52,70.48 57.15,69.85 R312.2
  Bottom 2.54: X105.3 72.97,13.39 66.67,19.68 66.67,42.55 63.5,45.72 63.5,63.5 58.68,68.32 R312.2
  other vias: 56.52,73.66
N  (via drill 0.5 pad 2.54, 0.5 pad 3.81)
  Bottom 3.81: v15.24,22.23 15.24,18.41 22.23,11.43 X102.2
  other vias: 22.23,5.71
N$1  (via drill 0.5 pad 6.45)
  other vias: 5,5
N$2  (via drill 0.5 pad 6.45)
  other vias: 95,5
N$3  (via drill 0.5 pad 6.45)
  other vias: 5,155
N$4  (via drill 0.5 pad 6.45)
  other vias: 95,155
N$5
  Top 0.813: D202.A D203.C 67.31,13.97 68.58,15.24 70.16,15.24 | 70.16,15.24 IC201.7 | 70.16,15.24 IC201.6
N$6
  Top 0.813: D311.C 63.19,104.78 R314.1
N$7
  Top 0.813: Q303.G 53.98,63.5 | 53.98,63.5 55.88,63.5 | 55.88,63.5 57.78,63.5 | 57.78,63.5 59.05,63.5 60.01,64.45 R306.2 R303.2 | 55.88,63.5 D309.C | 57.78,63.5 R309.2 | 53.98,63.5 C303.1
N$8
  Top 0.813: D310.C 63.19,88.28 R313.1
N$9  (via drill 0.5 pad 3.81)
  Bottom 3.81: K201.O 24.38,51.82 R207.2
  other vias: 26.04,50.16
N$10  (via drill 0.5 pad 2.18)
  Bottom 0.813: R203.1 R205.2
  other vias: 19.68,156.21 22.23,156.21
N$11
  Top 0.813: D202.C 63.19,17.79 R204.1
N$12
  Top 0.813: R206.1 62.87,13.97 64.14,15.24 66.04,15.24 67.31,16.51 D203.A
N$13
  Top 0.813: Q201.G 53.98,11.43 | 53.98,11.43 55.88,11.43 | 55.88,11.43 57.78,11.43 | 57.78,11.43 59.05,11.43 60.01,12.38 R206.2 R204.2 | 55.88,11.43 D204.C | 53.98,11.43 C205.1 | 57.78,11.43 R209.2
N$14  (via drill 0.5 pad 2.18, 0.5 pad 3.81)
  Bottom 3.81: K201.S 5.08,52.7 R201.1 v5.08,22.23
  other vias: 5.08,49.53 12.45,60.07
N$16  (via drill 0.5 pad 2.18)
  Bottom 0.813: R202.1 R203.2
  other vias: 14.61,156.21 17.14,156.21
N$17  (via drill 0.5 pad 2.18)
  other vias: 24.38,60.07
N$18  (via drill 0.5 pad 5.08)
  other vias: 31.94,49.53
N$19  (via drill 0.5 pad 5.08)
  other vias: 31.94,31.75
N$20  (via drill 0.5 pad 5.08)
  other vias: 31.94,67.37
N$21  (via drill 0.5 pad 5.08)
  other vias: 31.94,85.72
N$22  (via drill 0.5 pad 5.08)
  other vias: 31.94,102.23
N$23  (via drill 0.5 pad 5.08)
  other vias: 31.94,118.75
N$24  (via drill 0.5 pad 2.18)
  Bottom 0.813: R205.1 24.77,154.94 21.59,151.76 21.59,133.35 23.5,131.44 R210.1
  other vias: 24.77,156.21 43.81,131.44
N$25  (via drill 0.5 pad 5.08)
  other vias: 31.94,15.24
N$26
  Top 0.813: R317.1 62.87,100.97 64.14,102.23 66.04,102.23 67.31,103.5 D314.A
N$27  (via drill 0.5 pad 2.18)
  Top 0.813: v79.38,137.16 79.38,139.7 82.55,142.88 v87.63,142.88
  Bottom 0.61: v87.63,142.88 SV101.4
  Bottom 0.813: v79.38,137.16 v79.38,125.09 79.38,123.83 80.64,122.56 80.64,76.2 79.38,74.93 v79.38,73.66 79.38,72.39 80.64,71.12 80.64,57.78 79.38,56.52 v79.38,55.88 79.38,55.24 80.64,53.98 80.64,40.01 79.38,38.73 v79.38,38.1
  other vias: 87.63,145.41
N$28  (via drill 0.5 pad 2.18)
  Bottom 0.61: IC401.4 26.73,140.28 R401.1
  Bottom 0.813: R401.1 R402.2
  other vias: 26.67,139.06
N$29  (via drill 0.5 pad 5.08)
  other vias: 12.7,36.2
N$30
  Top 0.813: R316.1 62.87,84.45 64.14,85.72 66.04,85.72 67.31,87 D313.A
N$31  (via drill 0.5 pad 2.18)
  Top 0.813: K201.2 24.77,72.26 24.77,123.19 25.57,124 Q202.C
  Bottom 0.813: D205.A 22.48,67.31 v24.38,69.22
  Bottom 2.184: v24.38,69.22 K201.2
  other vias: 24.38,72.26
N$32
  Top 0.813: Q202.B R213.2 R212.2
N$33  (via drill 0.5 pad 2.18)
  other vias: 79.38,137.16
N$34  (via drill 0.5 pad 1.52)
  other vias: 38.1,147
N$35
  Top 0.813: Q305.G 53.98,98.42 | 53.98,98.42 55.88,98.42 | 55.88,98.42 57.78,98.42 | 57.78,98.42 59.05,98.42 60.01,99.38 R317.2 R314.2 | 55.88,98.42 D317.C | 53.98,98.42 C305.1 | 57.78,98.42 R320.2
N$36
  Top 0.813: Q304.G 53.98,81.92 | 53.98,81.92 55.88,81.92 | 55.88,81.92 57.78,81.92 | 57.78,81.92 59.05,81.92 60.01,82.87 R316.2 R313.2 | 57.78,81.92 R319.2 | 55.88,81.92 D316.C | 53.98,81.92 C304.1
N$37
  Top 0.813: D302.C 63.19,52.08 R302.1
N$38
  Top 0.813: R305.1 62.87,48.26 64.14,49.53 66.04,49.53 67.31,50.8 D305.A
N$39
  Top 0.813: D301.C 63.19,34.3 R301.1
N$40
  Top 0.813: Q302.G 53.98,45.72 | 53.98,45.72 55.88,45.72 | 55.88,45.72 57.78,45.72 | 57.78,45.72 59.05,45.72 60.01,46.67 R305.2 R302.2 | 55.88,45.72 D308.C | 53.98,45.72 C302.1 | 57.78,45.72 R308.2
N$41
  Top 0.813: R304.1 62.87,30.48 64.14,31.75 66.04,31.75 67.31,33.02 D304.A
N$42  (via drill 0.5 pad 3.05)
  Bottom 0.813: D101.A 36.34,151.13 34.29,151.13 31.11,154.31 X101.3 v30.48,154.31
N$43
  Top 0.813: Q301.G 53.98,27.94 | 53.98,27.94 55.88,27.94 | 55.88,27.94 57.78,27.94 | 57.78,27.94 59.05,27.94 60.01,28.89 R304.2 R301.2 | 57.78,27.94 R307.2 | 55.88,27.94 D307.C | 53.98,27.94 C301.1
N$44
  Top 0.813: D303.C 63.19,69.86 R303.1
N$45
  Top 0.813: R306.1 62.87,66.04 64.14,67.31 66.04,67.31 67.31,68.58 D306.A
N$47
  Top 0.813: D312.C 63.19,121.3 R315.1
N$48
  Top 0.813: R318.1 62.87,117.47 64.14,118.75 66.04,118.75 67.31,120.02 D315.A
N$49
  Top 0.813: Q306.G 53.98,114.94 | 53.98,114.94 55.88,114.94 | 55.88,114.94 57.78,114.94 | 57.78,114.94 59.05,114.94 60.01,115.89 R318.2 R315.2 | 55.88,114.94 D318.C | 57.78,114.94 R321.2 | 53.98,114.94 C306.1
N$57  (via drill 0.5 pad 3.05)
  other vias: 35.56,154.31
N$58  (via drill 0.5 pad 2.18)
  other vias: 64.77,147.96
N$59  (via drill 0.5 pad 2.18)
  other vias: 62.23,147.96
N$60  (via drill 0.5 pad 2.18)
  other vias: 59.69,147.96
N$61  (via drill 0.5 pad 2.18)
  other vias: 57.15,147.96
N$62  (via drill 0.5 pad 2.18)
  other vias: 54.61,147.96
N$63  (via drill 0.5 pad 2.18)
  other vias: 52.07,147.96
N$64  (via drill 0.5 pad 2.18)
  other vias: 49.53,147.96
N$65  (via drill 0.5 pad 2.18)
  other vias: 49.53,145.41
N$66  (via drill 0.5 pad 2.18)
  other vias: 52.07,145.41
N$67  (via drill 0.5 pad 2.18)
  other vias: 54.61,145.41
N$72
  Bottom 0.813: C401.2 33.66,144.21 IC401.8 32.94,144.93 D401.C
  Bottom 1.27: L401.P$1 36.56,147.05 35.56,146.05 D401.C
N$80
  Bottom 0.813: C401.1 33.66,141.54 IC401.1
PE  (via drill 0.5 pad 2.54)
  Bottom 0.406: X102.3 v27.3,5.71 | X104.3 v57.78,5.71 | X105.4 v78.11,5.71 | X103.3 v42.55,5.71
  Bottom 2.184: X102.3 27.23,2.62 27.94,1.91 42.55,1.91 | X104.3 57.78,5.64 57.78,1.91 | X103.3 42.47,1.98 42.55,1.91 | 42.55,1.91 57.78,1.91 | 57.78,1.91 76.83,1.91 78.11,3.17 78,3.28 X105.4
PWM1_H  (via drill 0.5 pad 2.18)
  Top 0.61: v69.85,142.88 78.74,133.99 91.76,133.99 96.2,129.54 96.2,120.65 93.98,118.43 93.98,38.1 89.05,33.17 R102.2
  Bottom 0.61: v69.85,142.88 SV101.18
  other vias: 69.85,145.41
PWM1_L  (via drill 0.5 pad 2.18)
  Top 0.61: v62.23,142.88 74.93,130.18 90.81,130.18 93.34,127.64 93.34,122.56 90.17,119.38 90.17,90.81 86.51,87.15 R105.2
  Bottom 0.61: v62.23,142.88 SV101.24
  other vias: 62.23,145.41
PWM2_H  (via drill 0.5 pad 2.18)
  Top 0.61: v67.31,142.88 77.47,132.72 91.44,132.72 95.25,128.91 95.25,121.28 92.71,118.75 92.71,55.88 87.78,50.95 R103.2
  Bottom 0.61: v67.31,142.88 SV101.20
  other vias: 67.31,145.41
PWM2_L  (via drill 0.5 pad 2.18)
  Top 0.61: v59.69,142.88 73.66,128.91 90.49,128.91 92.39,127 92.39,123.19 88.9,119.7 88.9,106.05 86.51,103.66 R106.2
  Bottom 0.61: v59.69,142.88 SV101.26
  other vias: 59.69,145.41
PWM3_H  (via drill 0.5 pad 2.18)
  Top 0.61: v64.77,142.88 76.2,131.44 91.12,131.44 94.3,128.27 94.3,121.92 91.44,119.06 91.44,72.39 87.78,68.73 R104.2
  Bottom 0.61: v64.77,142.88 SV101.22
  other vias: 64.77,145.41
PWM3_L  (via drill 0.5 pad 2.18)
  Top 0.61: v57.15,142.88 72.39,127.64 90.17,127.64 91.44,126.36 91.44,123.83 87.78,120.17 R107.2
  Bottom 0.61: v57.15,142.88 SV101.28
  other vias: 57.15,145.41
RB-  (via drill 0.5 pad 2.54)
  Bottom 2.184: 45.72,15.24 45.72,11.92 D201.A
  Bottom 2.54: X104.2 52.7,8.26 54.61,10.16 54.61,13.97 53.34,15.24 Q201.D 45.72,15.24
  other vias: 52.7,5.71
VBUS  (via drill 0.5 pad 2.18)
  Bottom 0.61: HIC705.7 89.53,137.79 85.09,142.24 SV101.6
  other vias: 89.53,137.16 85.09,145.41

### Text on the board
tDocu: L | N | PE | DC+ | DC- | PE | RB+ | RB- | PE | U | V | W | PE | INPUT LINE | DC BUS | Br.Resistor | MOTOR